# EAGLE schematic Sensor_POD (EAGLE 9.0.1)

## Sheet 1 of 8: Pre-amp (DONE)
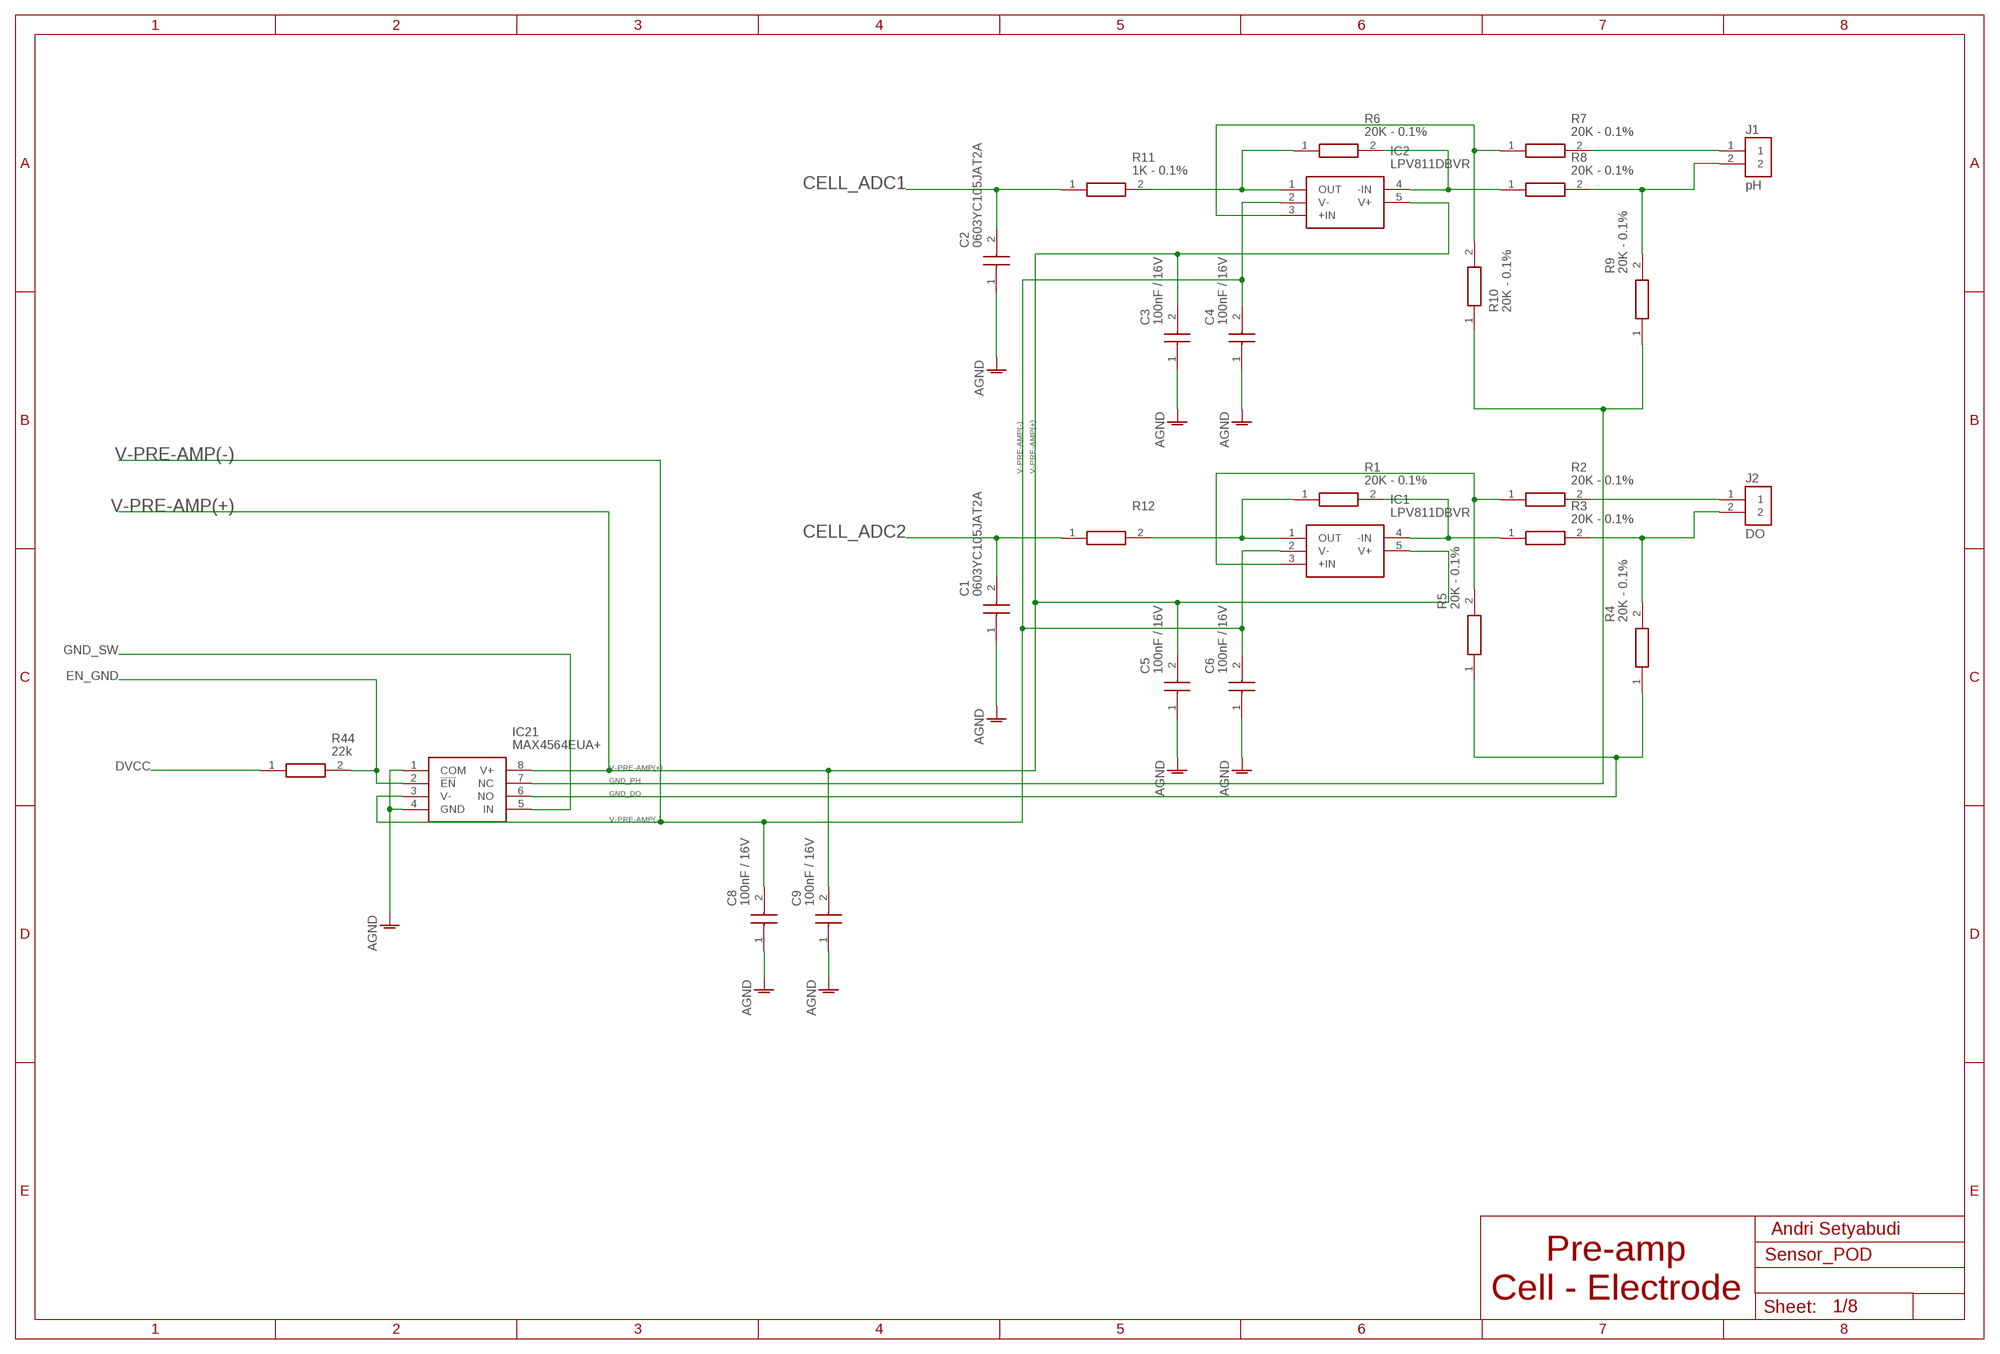
[diagram p0: schematic, sheet 1]

### Parts
C1  0603YC105JAT2A  [CAPC1608X90N]
C2  0603YC105JAT2A  [CAPC1608X90N]
C3  100nF / 16V  0603YC104JAT2A  [CAPC1608X90N]
C4  100nF / 16V  0603YC104JAT2A  [CAPC1608X90N]
C5  100nF / 16V  0603YC104JAT2A  [CAPC1608X90N]
C6  100nF / 16V  0603YC104JAT2A  [CAPC1608X90N]
C8  100nF / 16V  0603YC104JAT2A  [CAPC1608X90N]
C9  100nF / 16V  0603YC104JAT2A  [CAPC1608X90N]
IC1  LPV811DBVR  [SOT95P280X145-5N]
IC2  LPV811DBVR  [SOT95P280X145-5N]
IC21  MAX4564EUA+  [SOP65P490X110-8N]
J1  pH  B2B-PH-K-S(LF)(SN)  [JST_B2B-PH-K-S(LF)(SN)]
J2  DO  B2B-PH-K-S(LF)(SN)  [JST_B2B-PH-K-S(LF)(SN)]
R1  20K - 0.1%  ERA3AED203V  [RESC1608X55N@2]
R2  20K - 0.1%  ERA3AED203V  [RESC1608X55N@2]
R3  20K - 0.1%  ERA3AED203V  [RESC1608X55N@2]
R4  20K - 0.1%  ERA3AED203V  [RESC1608X55N@2]
R5  20K - 0.1%  ERA3AED203V  [RESC1608X55N@2]
R6  20K - 0.1%  ERA3AED203V  [RESC1608X55N@2]
R7  20K - 0.1%  ERA3AED203V  [RESC1608X55N@2]
R8  20K - 0.1%  ERA3AED203V  [RESC1608X55N@2]
R9  20K - 0.1%  ERA3AED203V  [RESC1608X55N@2]
R10  20K - 0.1%  ERA3AED203V  [RESC1608X55N@2]
R11  1K - 0.1%  RG1608P-102-B-T5  [RESC1608X50N]
R12  RG1608P-102-B-T5  [RESC1608X50N]
R44  22k  RT0603FRE0722KL  [RESC1608X55N]

### Nets
AGND: C1.1 C2.1 C3.1 C4.1 C5.1 C6.1 C8.1 C9.1 IC21.1(COM) IC21.4(GND) ; also sheet 2,4,5,6
CELL_ADC1: C2.2 R11.1 ; also sheet 6
CELL_ADC2: C1.2 R12.1 ; also sheet 6
DVCC: R44.1 ; also sheet 2,3,4,5,6,7
EN_GND: IC21.2(!EN) R44.2 ; also sheet 7
GND_DO: IC21.6(NO) R4.1 R5.1
GND_PH: IC21.7(NC) R9.1 R10.1
GND_SW: IC21.5(IN) ; also sheet 7
N$1: IC1.4(-IN) R1.2 R3.1
N$2: IC1.1(OUT) R1.1 R12.2
N$4: IC1.3(+IN) R2.1 R5.2
N$5: J2.2 R3.2 R4.2
N$6: J2.1 R2.2
N$10: IC2.4(-IN) R6.2 R8.1
N$11: IC2.1(OUT) R6.1 R11.2
N$12: IC2.3(+IN) R7.1 R10.2
N$13: J1.2 R8.2 R9.2
N$14: J1.1 R7.2
V-PRE-AMP(+): C3.2 C5.2 C9.2 IC1.5(V+) IC2.5(V+) IC21.8(V+) ; also sheet 3
V-PRE-AMP(-): C4.2 C6.2 C8.2 IC1.2(V-) IC2.2(V-) IC21.3(V-) ; also sheet 3

### Notes on the sheet
- Andri Setyabudi
- Pre-amp
  Cell - Electrode

## Sheet 2 of 8: Power Supply
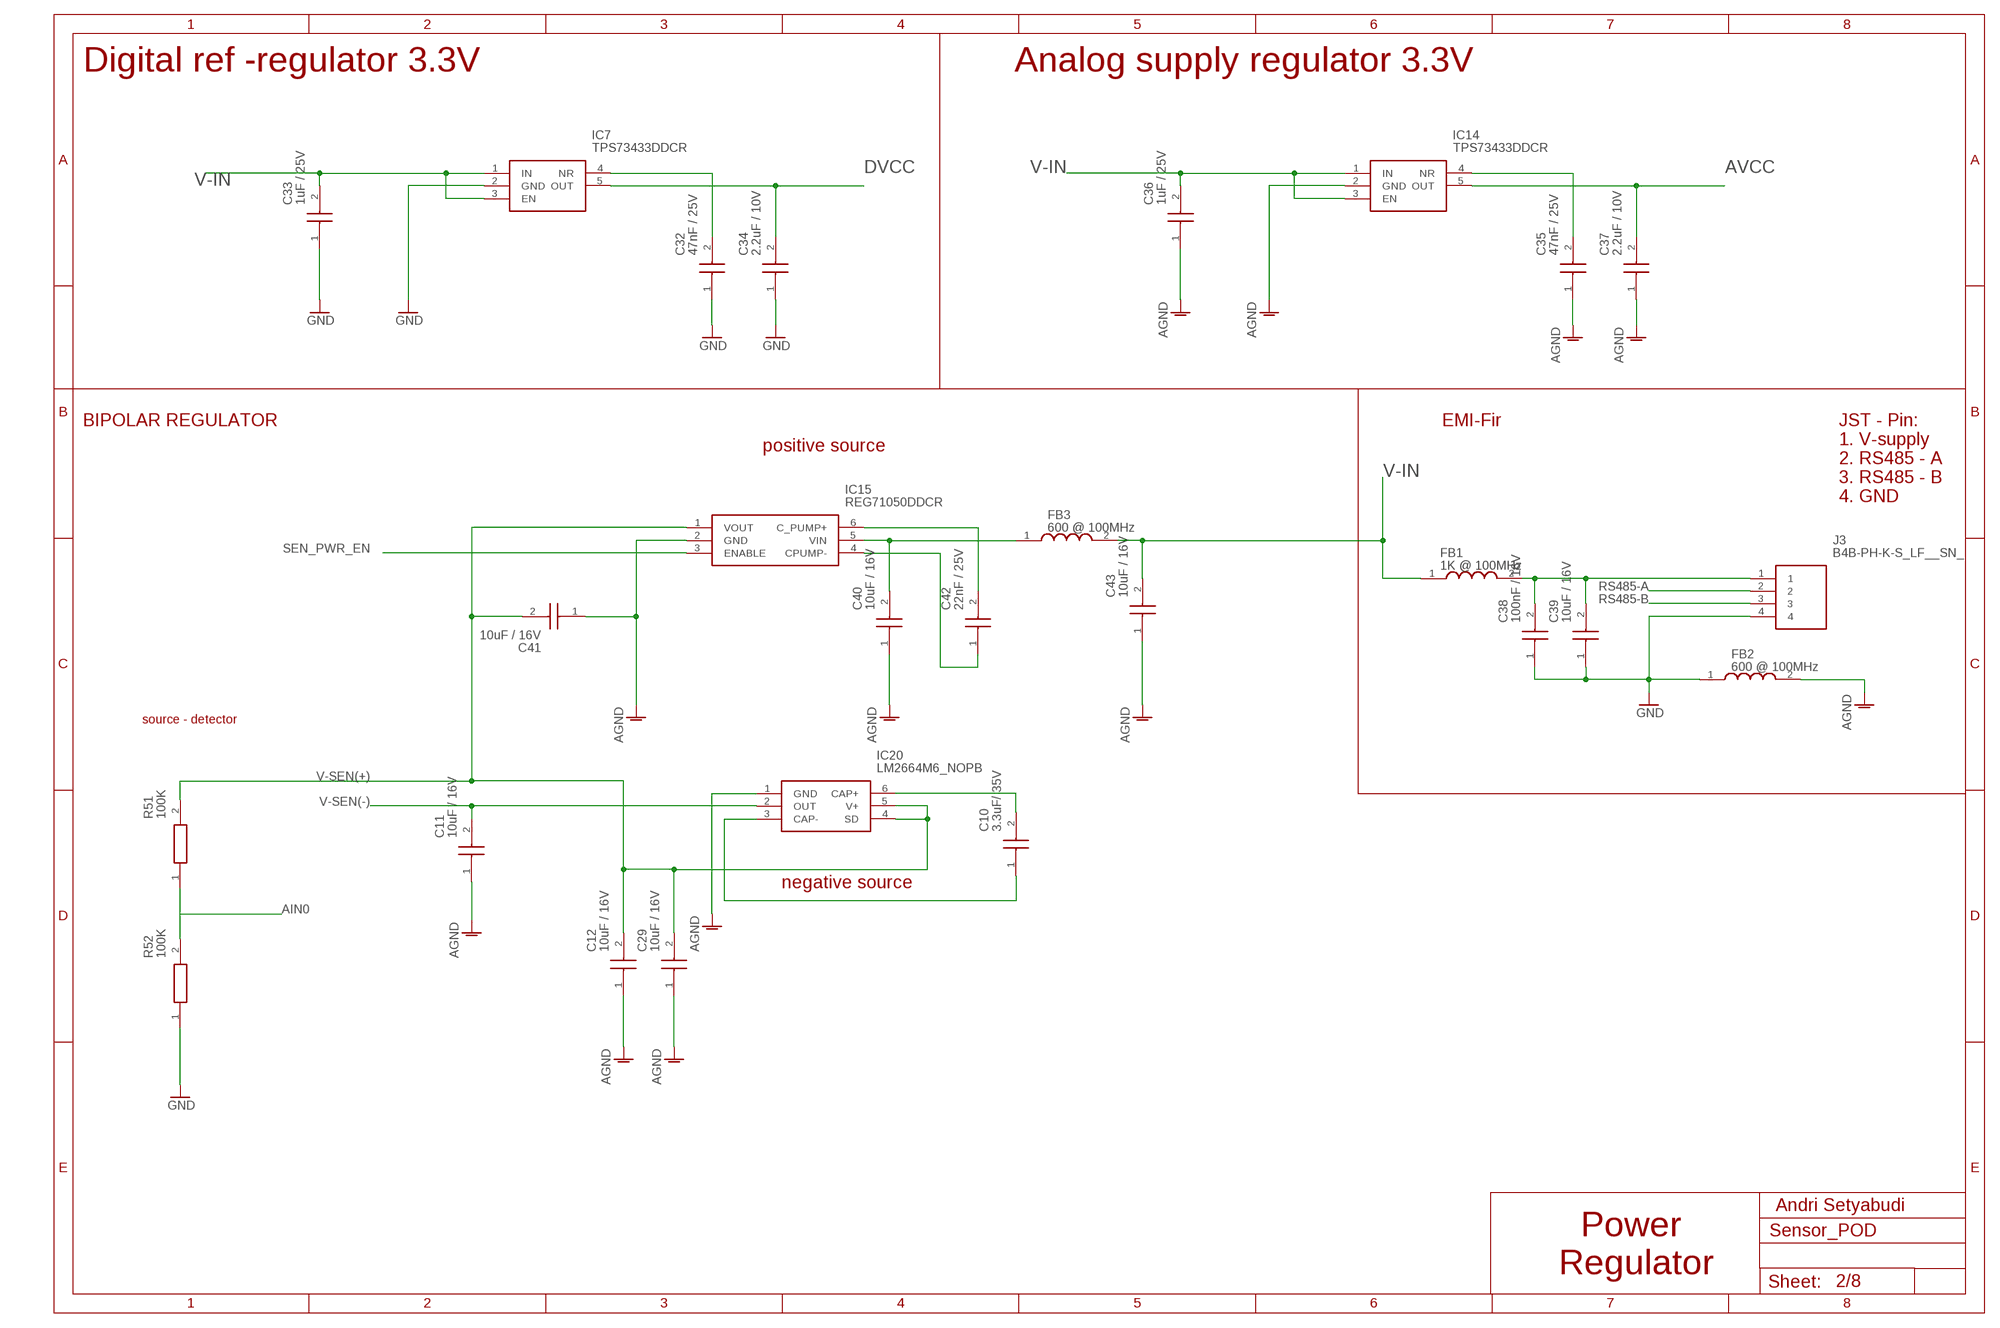
[diagram p1: schematic, sheet 2]

### Parts
C10  3.3uF/ 35V  0603YC105JAT2A  [CAPC1608X90N]
C11  10uF / 16V  EMK107BBJ106MA-T  [CAPC1608X100N]
C12  10uF / 16V  EMK107BBJ106MA-T  [CAPC1608X100N]
C29  10uF / 16V  EMK107BBJ106MA-T  [CAPC1608X100N]
C32  47nF / 25V  06033C473KAT2A  [CAPC1608X90N@1]
C33  1uF / 25V  TMK107B7105KA-T  [CAPC1608X90N@1]
C34  2.2uF / 10V  CL10B225KP8NFNC  [CAPC1608X90N@1]
C35  47nF / 25V  06033C473KAT2A  [CAPC1608X90N@1]
C36  1uF / 25V  TMK107B7105KA-T  [CAPC1608X90N@1]
C37  2.2uF / 10V  CL10B225KP8NFNC  [CAPC1608X90N@1]
C38  100nF / 16V  EMK107BJ104KAHT  [CAPC1608X90N@1]
C39  10uF / 16V  EMK107BBJ106MA-T  [CAPC1608X100N]
C40  10uF / 16V  EMK107BBJ106MA-T  [CAPC1608X100N]
C41  10uF / 16V  EMK107BBJ106MA-T  [CAPC1608X100N]
C42  22nF / 25V  CGA3E2X5R1E224K080AA  [CAPC1608X90N@1]
C43  10uF / 16V  EMK107BBJ106MA-T  [CAPC1608X100N]
FB1  1K @ 100MHz  BLM18KG102SH1D  [BLM18KG102SH1J]
FB2  600 @ 100MHz  MPZ1608S601ATA00  [BEADC1608X75N]
FB3  600 @ 100MHz  MPZ1608S601ATA00  [BEADC1608X75N]
IC7  TPS73433DDCR  [SOT95P280X110-5N]
IC14  TPS73433DDCR  [SOT95P280X110-5N]
IC15  REG71050DDCR  [SOT95P280X110-6N]
IC20  LM2664M6_NOPB  [SOT95P280X145-6N]
J3  B4B-PH-K-S_LF__SN_  [SHDR4W50P0X200_1X4_990X450X600]
R51  100K  RT0603DRE07100KL  [RESC1608X55N@1]
R52  100K  RT0603DRE07100KL  [RESC1608X55N@1]

### Nets
AGND: C11.1 C12.1 C29.1 C35.1 C36.1 C37.1 C40.1 C41.1 C43.1 FB2.2 IC14.2(GND) IC15.2(GND) IC20.1(GND) ; also sheet 1,4,5,6
AIN0: R51.1 R52.2 ; also sheet 7
AVCC: C37.2 IC14.5(OUT) ; also sheet 5,6
DVCC: C34.2 IC7.5(OUT) ; also sheet 1,3,4,5,6,7
GND: C32.1 C33.1 C34.1 C38.1 C39.1 FB2.1 IC7.2(GND) J3.4 R52.1 ; also sheet 3,5,6,7
N$7: C42.2 IC15.6(C_PUMP+)
N$8: C10.2 IC20.6(CAP+)
N$9: C42.1 IC15.4(CPUMP-)
N$15: C10.1 IC20.3(CAP-)
N$25: C32.2 IC7.4(NR)
N$26: C40.2 FB3.1 IC15.5(VIN)
N$27: C35.2 IC14.4(NR)
N$29: C38.2 C39.2 FB1.2 J3.1
RS485-A: J3.2 ; also sheet 7
RS485-B: J3.3 ; also sheet 7
SEN_PWR_EN: IC15.3(ENABLE) ; also sheet 7
V-IN: C33.2 C36.2 C43.2 FB1.1 FB3.2 IC7.1(IN) IC7.3(EN) IC14.1(IN) IC14.3(EN) ; also sheet 7
V-SEN(+): C12.2 C29.2 C41.2 IC15.1(VOUT) IC20.4(SD) IC20.5(V+) R51.2 ; also sheet 3,6
V-SEN(-): C11.2 IC20.2(OUT) ; also sheet 3,6

### Notes on the sheet
- Digital ref -regulator 3.3V | Analog supply regulator 3.3V
- BIPOLAR REGULATOR | EMI-Fir
- positive source
- JST - Pin:
  1. V-supply
  2. RS485 - A
  3. RS485 - B
  4. GND
- source - detector
- negative source
- Andri Setyabudi
- Power 
  Regulator

## Sheet 3 of 8: Analog Switch on/off (DONE)
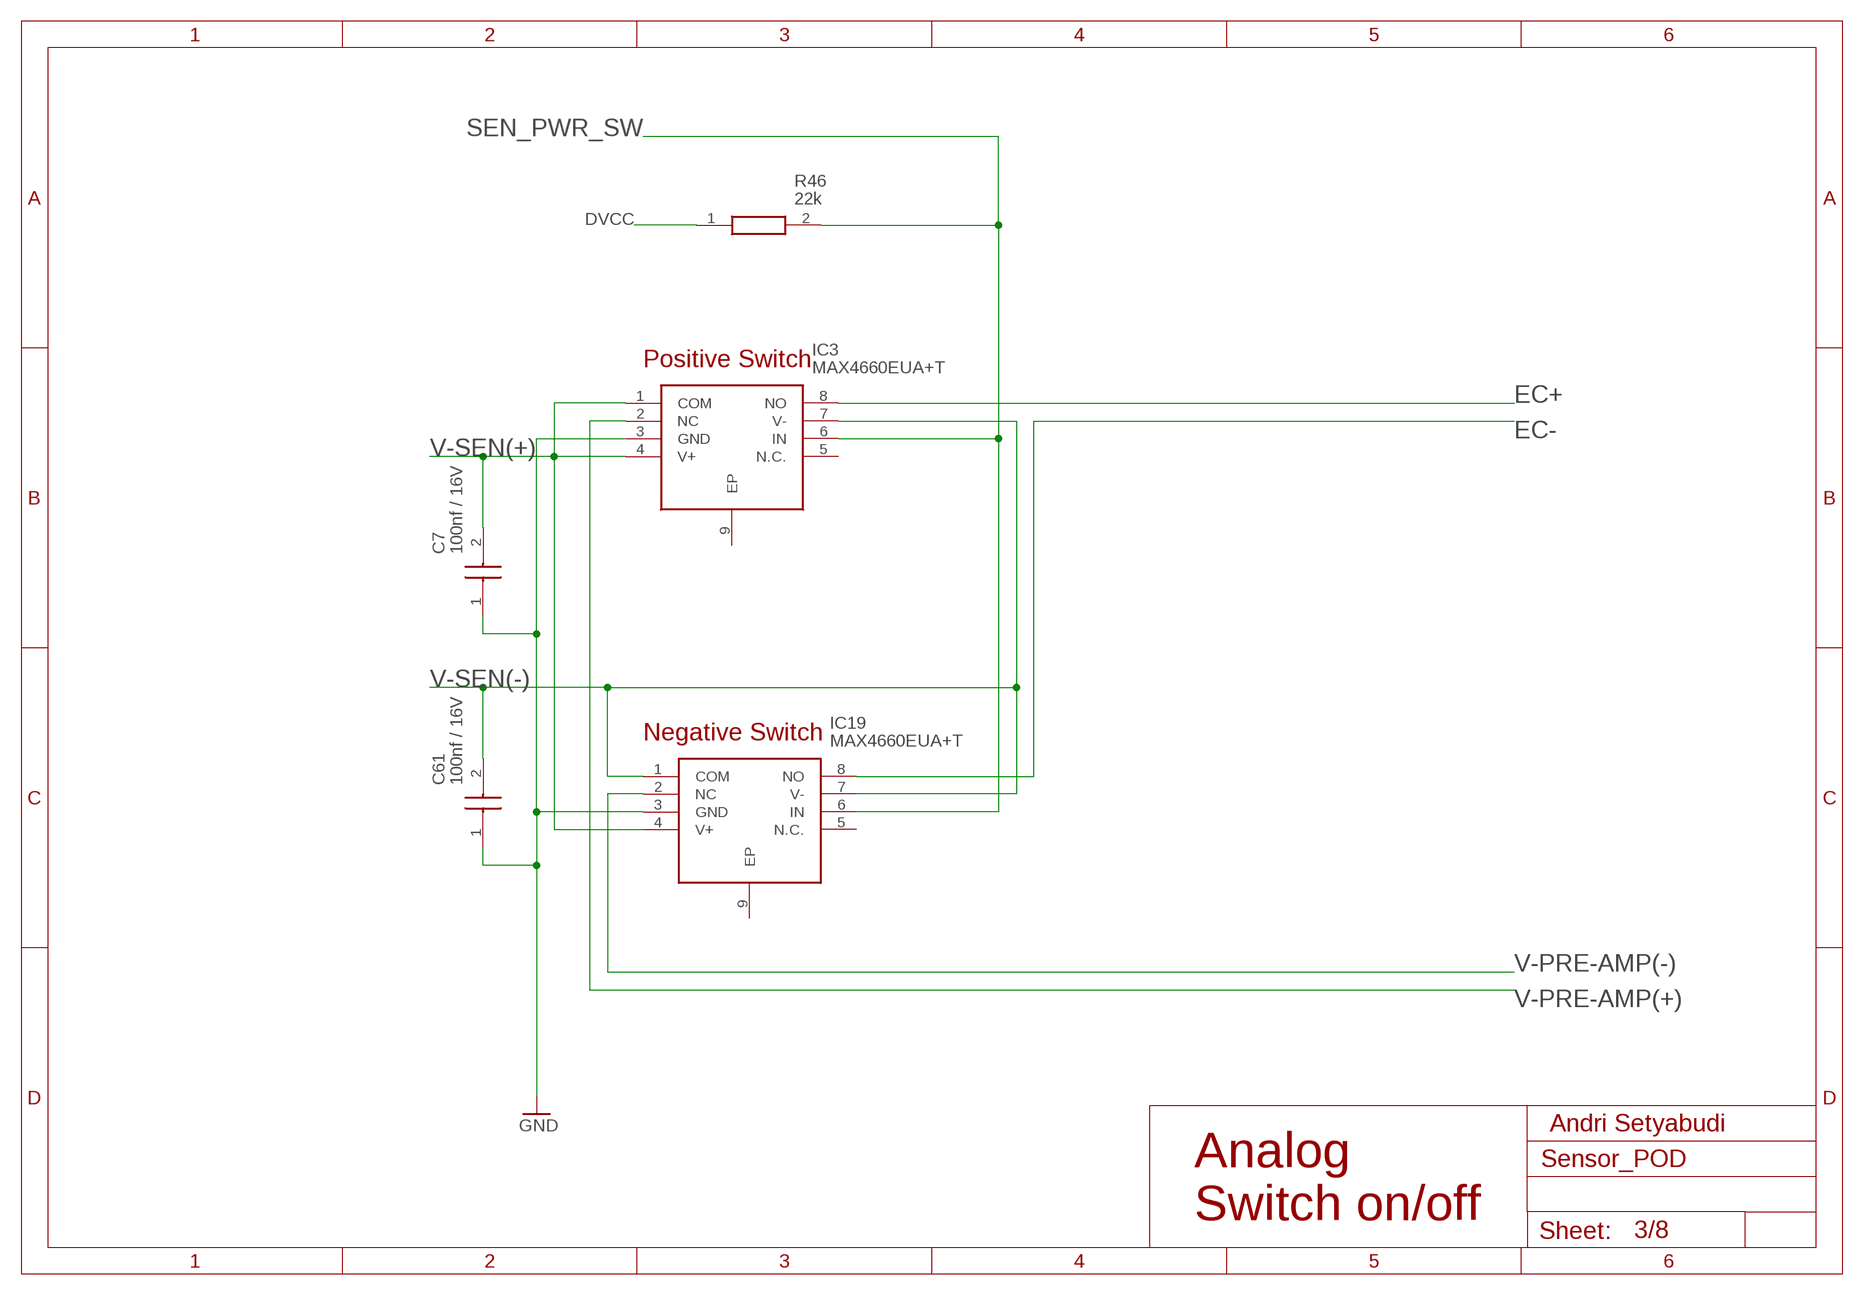
[diagram p2: schematic, sheet 3]

### Parts
C7  100nf / 16V  0603YC104JAT2A  [CAPC1608X90N]
C61  100nf / 16V  0603YC104JAT2A  [CAPC1608X90N]
IC3  MAX4660EUA+T  [SOP65P490X110-9N]
IC19  MAX4660EUA+T  [SOP65P490X110-9N]
R46  22k  RT0603FRE0722KL  [RESC1608X55N]

### Nets
DVCC: R46.1 ; also sheet 1,2,4,5,6,7
EC+: IC3.8(NO) ; also sheet 4
EC-: IC19.8(NO) ; also sheet 4
GND: C7.1 C61.1 IC3.3(GND) IC19.3(GND) ; also sheet 2,5,6,7
SEN_PWR_SW: IC3.6(IN) IC19.6(IN) R46.2
V-PRE-AMP(+): IC3.2(NC) ; also sheet 1
V-PRE-AMP(-): IC19.2(NC) ; also sheet 1
V-SEN(+): C7.2 IC3.1(COM) IC3.4(V+) IC19.4(V+) ; also sheet 2,6
V-SEN(-): C61.2 IC3.7(V-) IC19.1(COM) IC19.7(V-) ; also sheet 2,6
Unconnected: IC3.5(N.C.) IC3.9(EP) IC19.5(N.C.) IC19.9(EP)

### Notes on the sheet
- Positive Switch
- Negative Switch
- Andri Setyabudi
- Analog
  Switch on/off

## Sheet 4 of 8: Conductivity Driver (DONE)
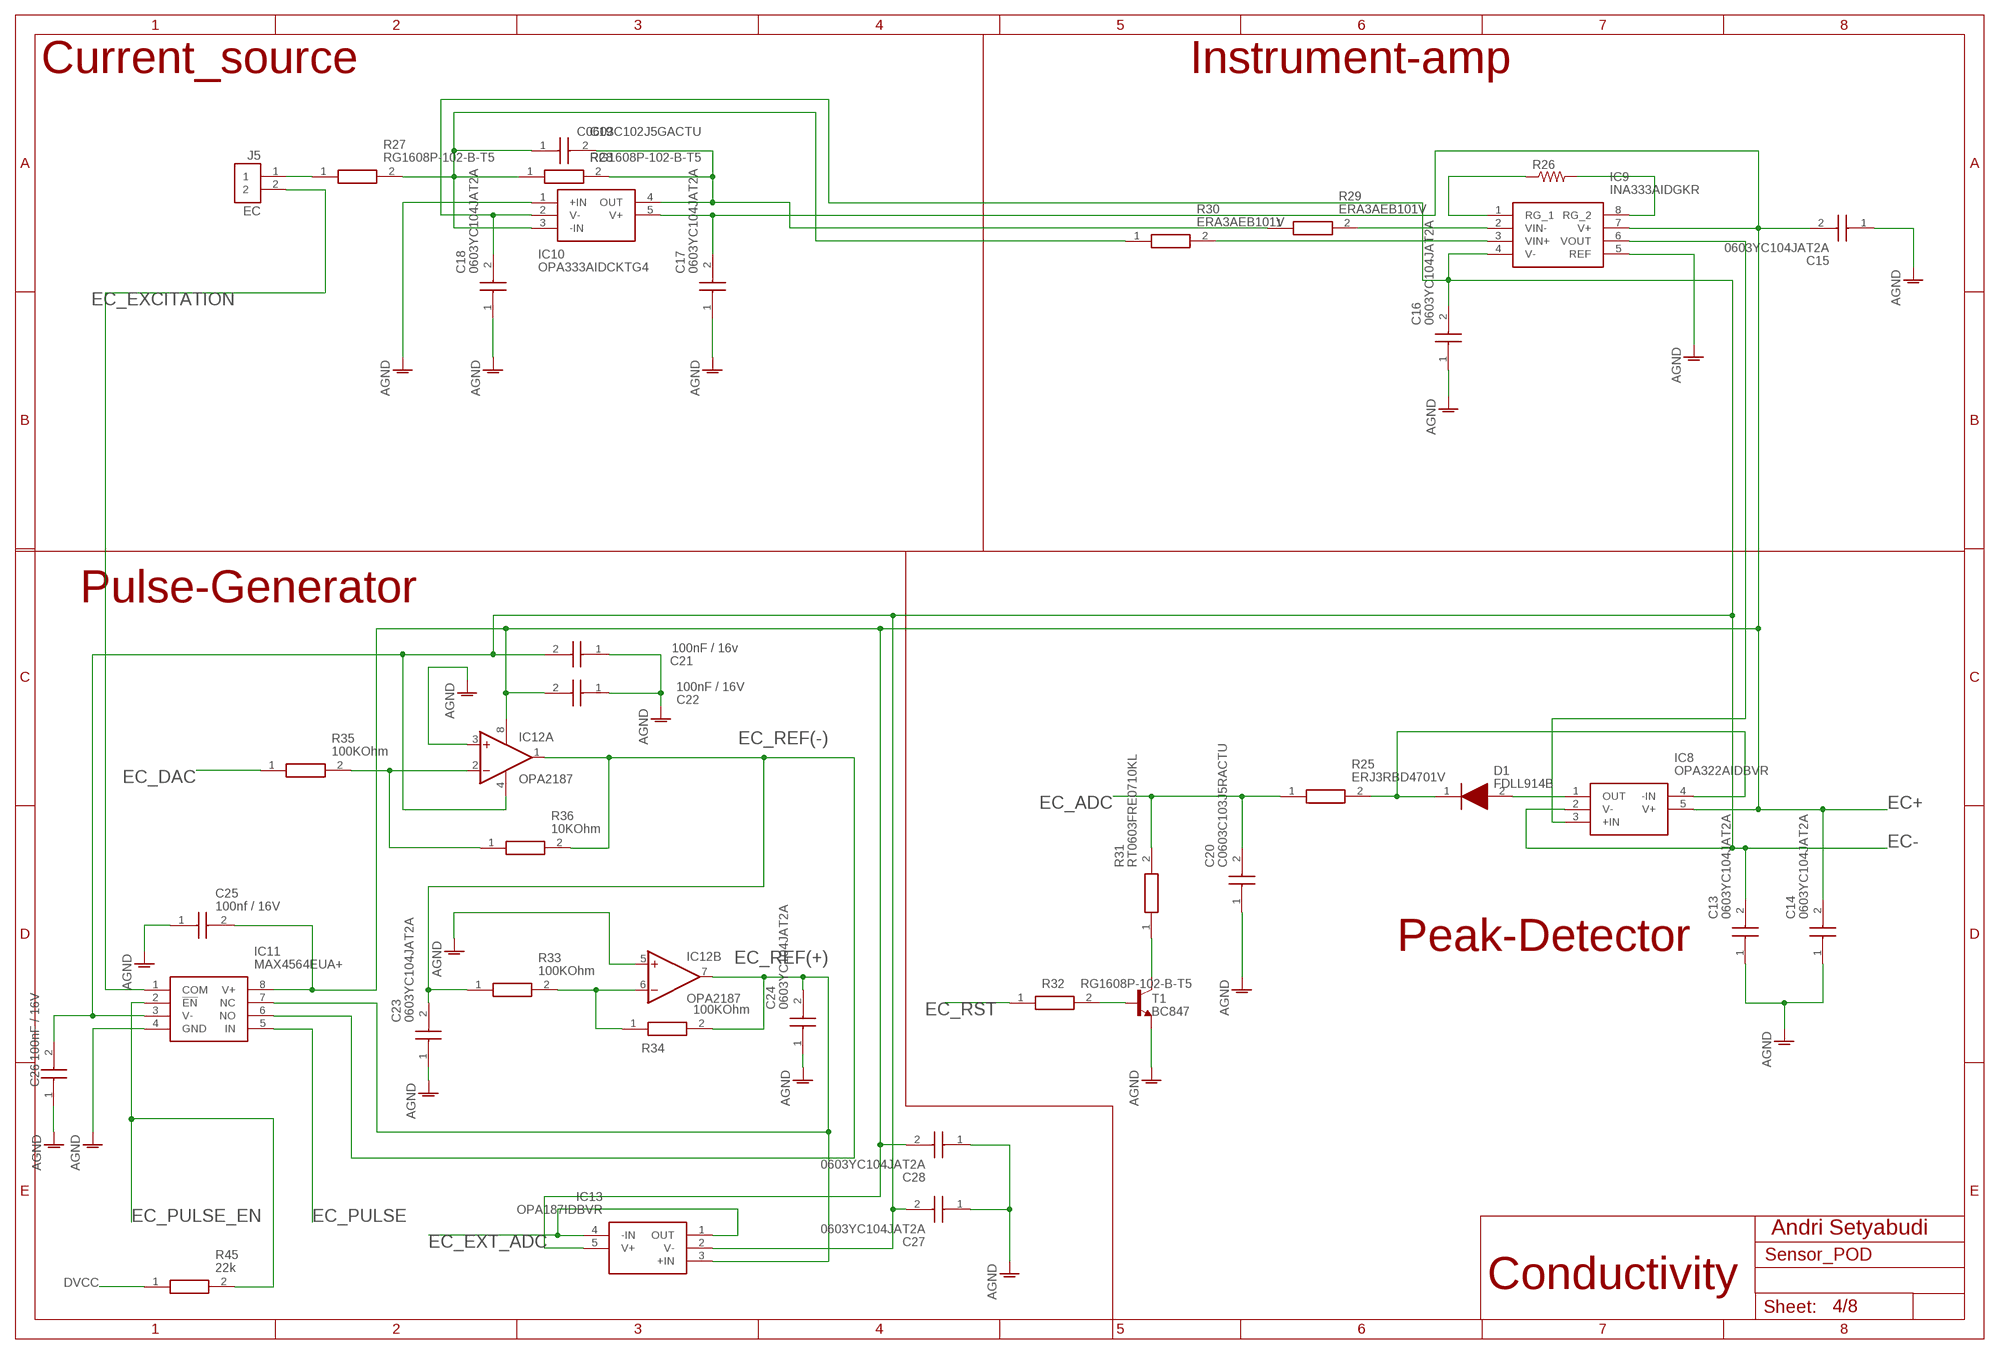
[diagram p3: schematic, sheet 4]

### Parts
C13  0603YC104JAT2A  [CAPC1608X90N]
C14  0603YC104JAT2A  [CAPC1608X90N]
C15  0603YC104JAT2A  [CAPC1608X90N]
C16  0603YC104JAT2A  [CAPC1608X90N]
C17  0603YC104JAT2A  [CAPC1608X90N]
C18  0603YC104JAT2A  [CAPC1608X90N]
C19  C0603C102J5GACTU  [CAPC1608X85N]
C20  C0603C103J5RACTU  [CAPC1608X87N]
C21  100nF / 16v  0603YC104JAT2A  [CAPC1608X90N]
C22  100nF / 16V  0603YC104JAT2A  [CAPC1608X90N]
C23  0603YC104JAT2A  [CAPC1608X90N]
C24  0603YC104JAT2A  [CAPC1608X90N]
C25  100nf / 16V  0603YC104JAT2A  [CAPC1608X90N]
C26  100nF / 16V  0603YC104JAT2A  [CAPC1608X90N]
C27  0603YC104JAT2A  [CAPC1608X90N]
C28  0603YC104JAT2A  [CAPC1608X90N]
D1  FDLL914B  [FDLL914B]
IC8  OPA322AIDBVR  [SOT95P280X145-5N]
IC9  INA333AIDGKR  [SOP65P490X110-8N]
IC10  OPA333AIDCKTG4  [SOT65P210X110-5N]
IC11  MAX4564EUA+  [SOP65P490X110-8N]
IC12  OPA2187  OPA2107D  [SO08]
IC13  OPA187IDBVR  [SOT95P280X145-5N]
J5  EC  B2B-PH-K-S(LF)(SN)  [JST_B2B-PH-K-S(LF)(SN)]
R25  ERJ3RBD4701V  [RESC1608X55N]
R26  R-US_R0603  [R0603]
R27  RG1608P-102-B-T5  [RESC1608X50N]
R28  RG1608P-102-B-T5  [RESC1608X50N]
R29  ERA3AEB101V  [RESC1608X55N@2]
R30  ERA3AEB101V  [RESC1608X55N@2]
R31  RT0603FRE0710KL  [RESC1608X55N@2]
R32  RG1608P-102-B-T5  [RESC1608X50N]
R33  100KOhm  RT0603DRE07100KL  [RESC1608X55N@1]
R34  100KOhm  RT0603DRE07100KL  [RESC1608X55N@1]
R35  100KOhm  RT0603DRE07100KL  [RESC1608X55N@1]
R36  10KOhm  RT0603FRE0710KL  [RESC1608X55N@2]
R45  22k  RT0603FRE0722KL  [RESC1608X55N]
T1  BC847  [SOT23]

### Nets
AGND: C13.1 C14.1 C15.1 C16.1 C17.1 C18.1 C20.1 C21.1 C22.1 C23.1 C24.1 C25.1 C26.1 C27.1 C28.1 IC9.5(REF) IC10.1(+IN) IC11.4(GND) IC12.3(A:+IN) IC12.5(B:+IN) T1.2(E) ; also sheet 1,2,5,6
DVCC: R45.1 ; also sheet 1,2,3,5,6,7
EC+: C14.2 C15.2 C17.2 C22.2 C25.2 C28.2 IC8.5(V+) IC9.7(V+) IC10.5(V+) IC11.8(V+) IC12.8(P:V+) IC13.5(V+) ; also sheet 3
EC-: C13.2 C16.2 C18.2 C21.2 C26.2 C27.2 IC8.2(V-) IC9.4(V-) IC10.2(V-) IC11.3(V-) IC12.4(P:V-) IC13.2(V-) ; also sheet 3
EC_ADC: C20.2 R25.1 R31.2 ; also sheet 6
EC_DAC: R35.1 ; also sheet 7
EC_EXCITATION: IC11.1(COM) J5.2
EC_EXT_ADC: IC13.1(OUT) IC13.4(-IN) ; also sheet 6
EC_PULSE: IC11.5(IN) ; also sheet 7
EC_PULSE_EN: IC11.2(!EN) R45.2 ; also sheet 7
EC_REF(+): C24.2 IC11.7(NC) IC12.7(B:OUT) IC13.3(+IN) R34.2
EC_REF(-): C23.2 IC11.6(NO) IC12.1(A:OUT) R33.1 R36.2
EC_RST: R32.1 ; also sheet 7
N$3: D1.2(A) IC8.1(OUT)
N$34: D1.1(K) IC8.4(-IN) R25.2
N$35: R31.1 T1.3(C)
N$36: R32.2 T1.1(B)
N$37: IC9.8(RG_2) R26.2
N$38: IC9.1(RG_1) R26.1
N$39: J5.1 R27.1
N$40: IC12.6(B:-IN) R33.2 R34.1
N$44: C19.1(C1) IC10.3(-IN) R27.2 R28.1 R30.1
N$45: C19.2(C2) IC10.4(OUT) R28.2 R29.1
N$46: IC9.2(VIN-) R29.2
N$47: IC9.3(VIN+) R30.2
N$48: IC12.2(A:-IN) R35.2 R36.1
N$50: IC8.3(+IN) IC9.6(VOUT)

### Notes on the sheet
- Current_source | Instrument-amp
- Pulse-Generator
- Peak-Detector
- Andri Setyabudi
- Conductivity

## Sheet 5 of 8: Temperature ( NTC ) Driver (DONE)
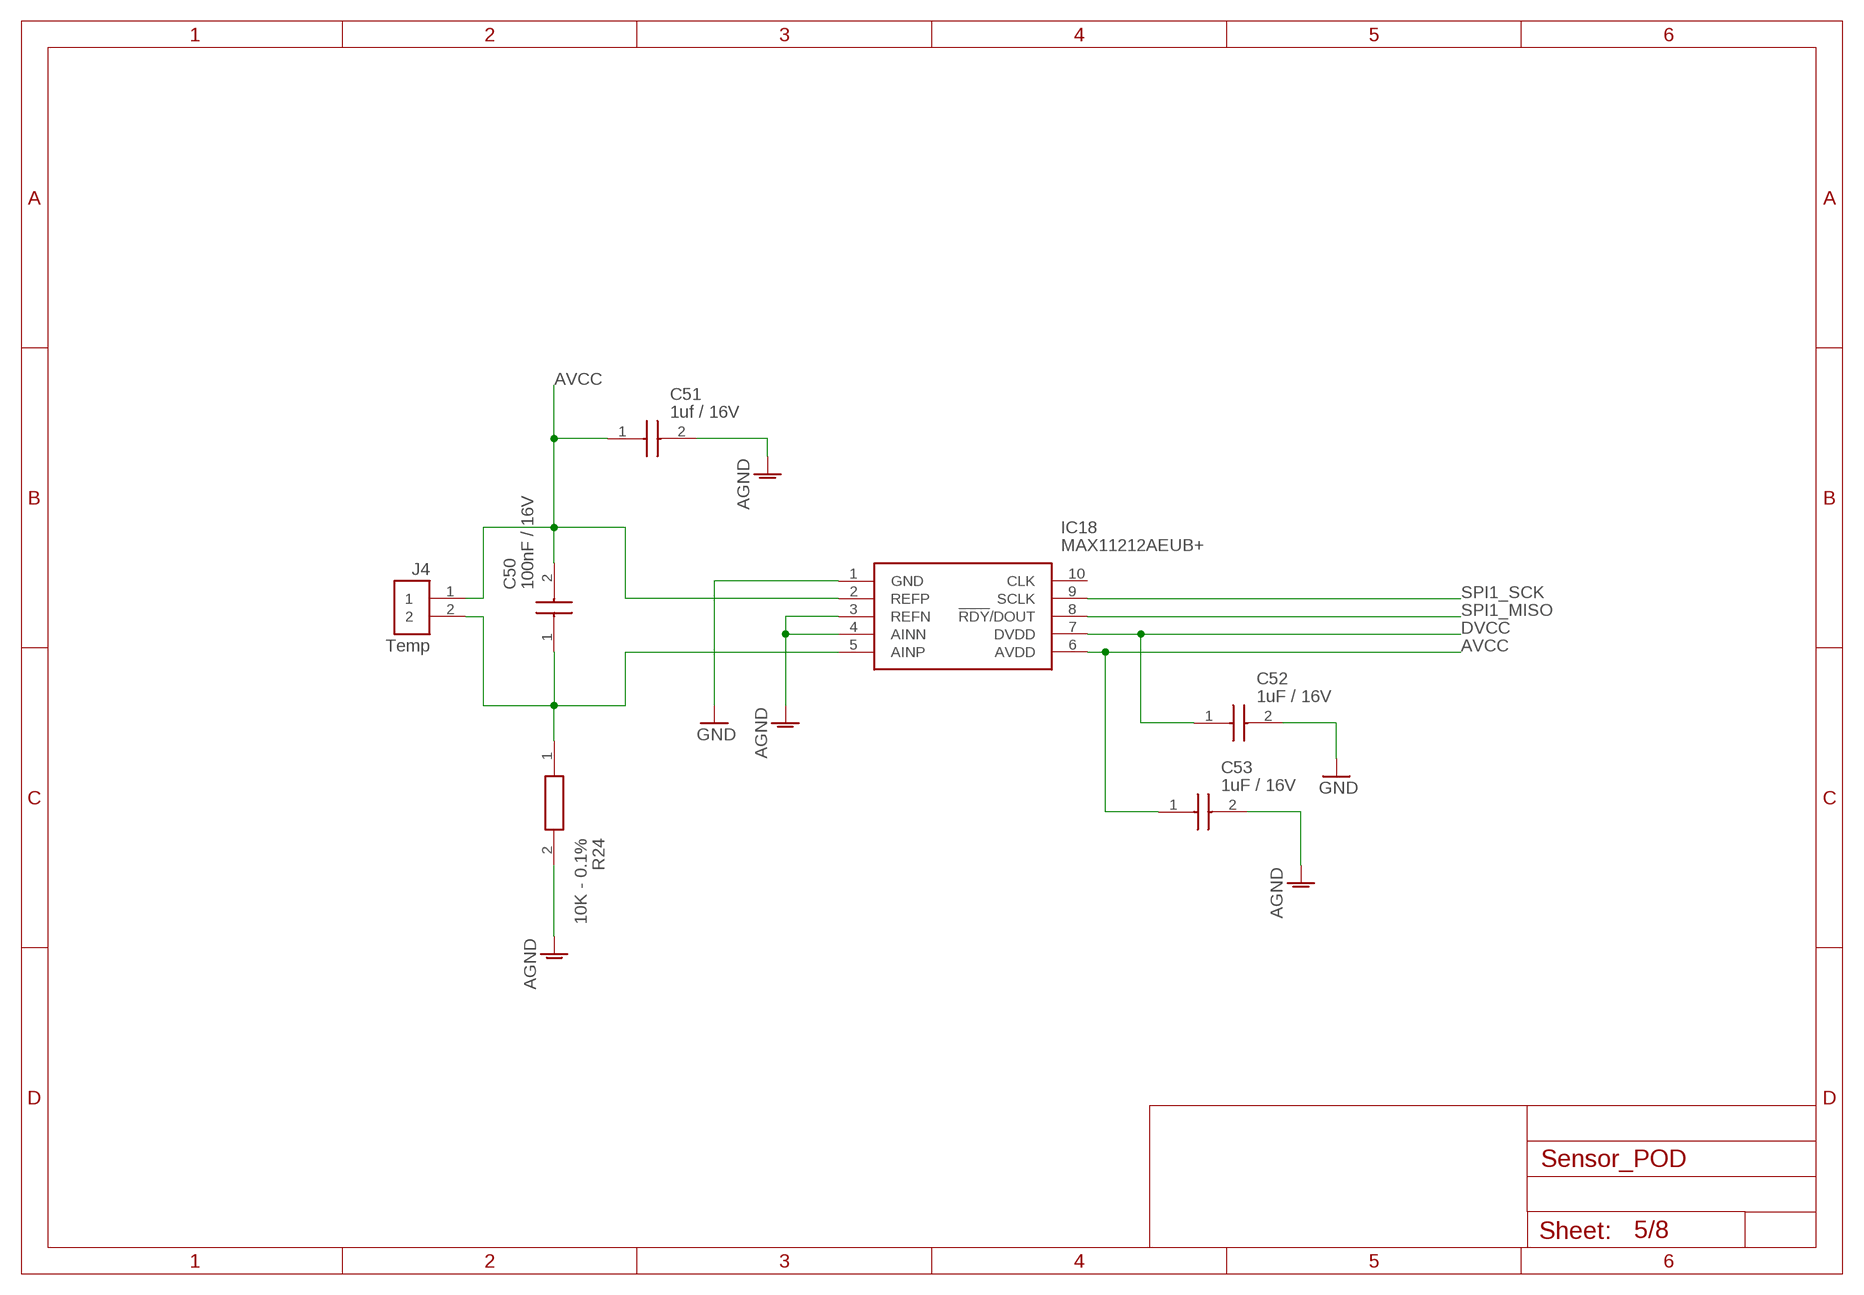
[diagram p4: schematic, sheet 5]

### Parts
C50  100nF / 16V  0603YC104JAT2A  [CAPC1608X90N]
C51  1uf / 16V  0603YC105JAT2A  [CAPC1608X90N]
C52  1uF / 16V  0603YC105JAT2A  [CAPC1608X90N]
C53  1uF / 16V  0603YC105JAT2A  [CAPC1608X90N]
IC18  MAX11212AEUB+  [SOP50P490X110-10N]
J4  Temp  B2B-PH-K-S(LF)(SN)  [JST_B2B-PH-K-S(LF)(SN)]
R24  10K - 0.1%  ERA-3AEB103V  [RESC1608X55N@2]

### Nets
AGND: C51.2 C53.2 IC18.3(REFN) IC18.4(AINN) R24.2 ; also sheet 1,2,4,6
AVCC: C50.2 C51.1 C53.1 IC18.2(REFP) IC18.6(AVDD) J4.1 ; also sheet 2,6
DVCC: C52.1 IC18.7(DVDD) ; also sheet 1,2,3,4,6,7
GND: C52.2 IC18.1(GND) ; also sheet 2,3,6,7
N$28: C50.1 IC18.5(AINP) J4.2 R24.1
SPI1_MISO: IC18.8(!RDY!/DOUT) ; also sheet 7
SPI1_SCK: IC18.9(SCLK) ; also sheet 7
Unconnected: IC18.10(CLK)

## Sheet 6 of 8: A/D Converter (DONE)
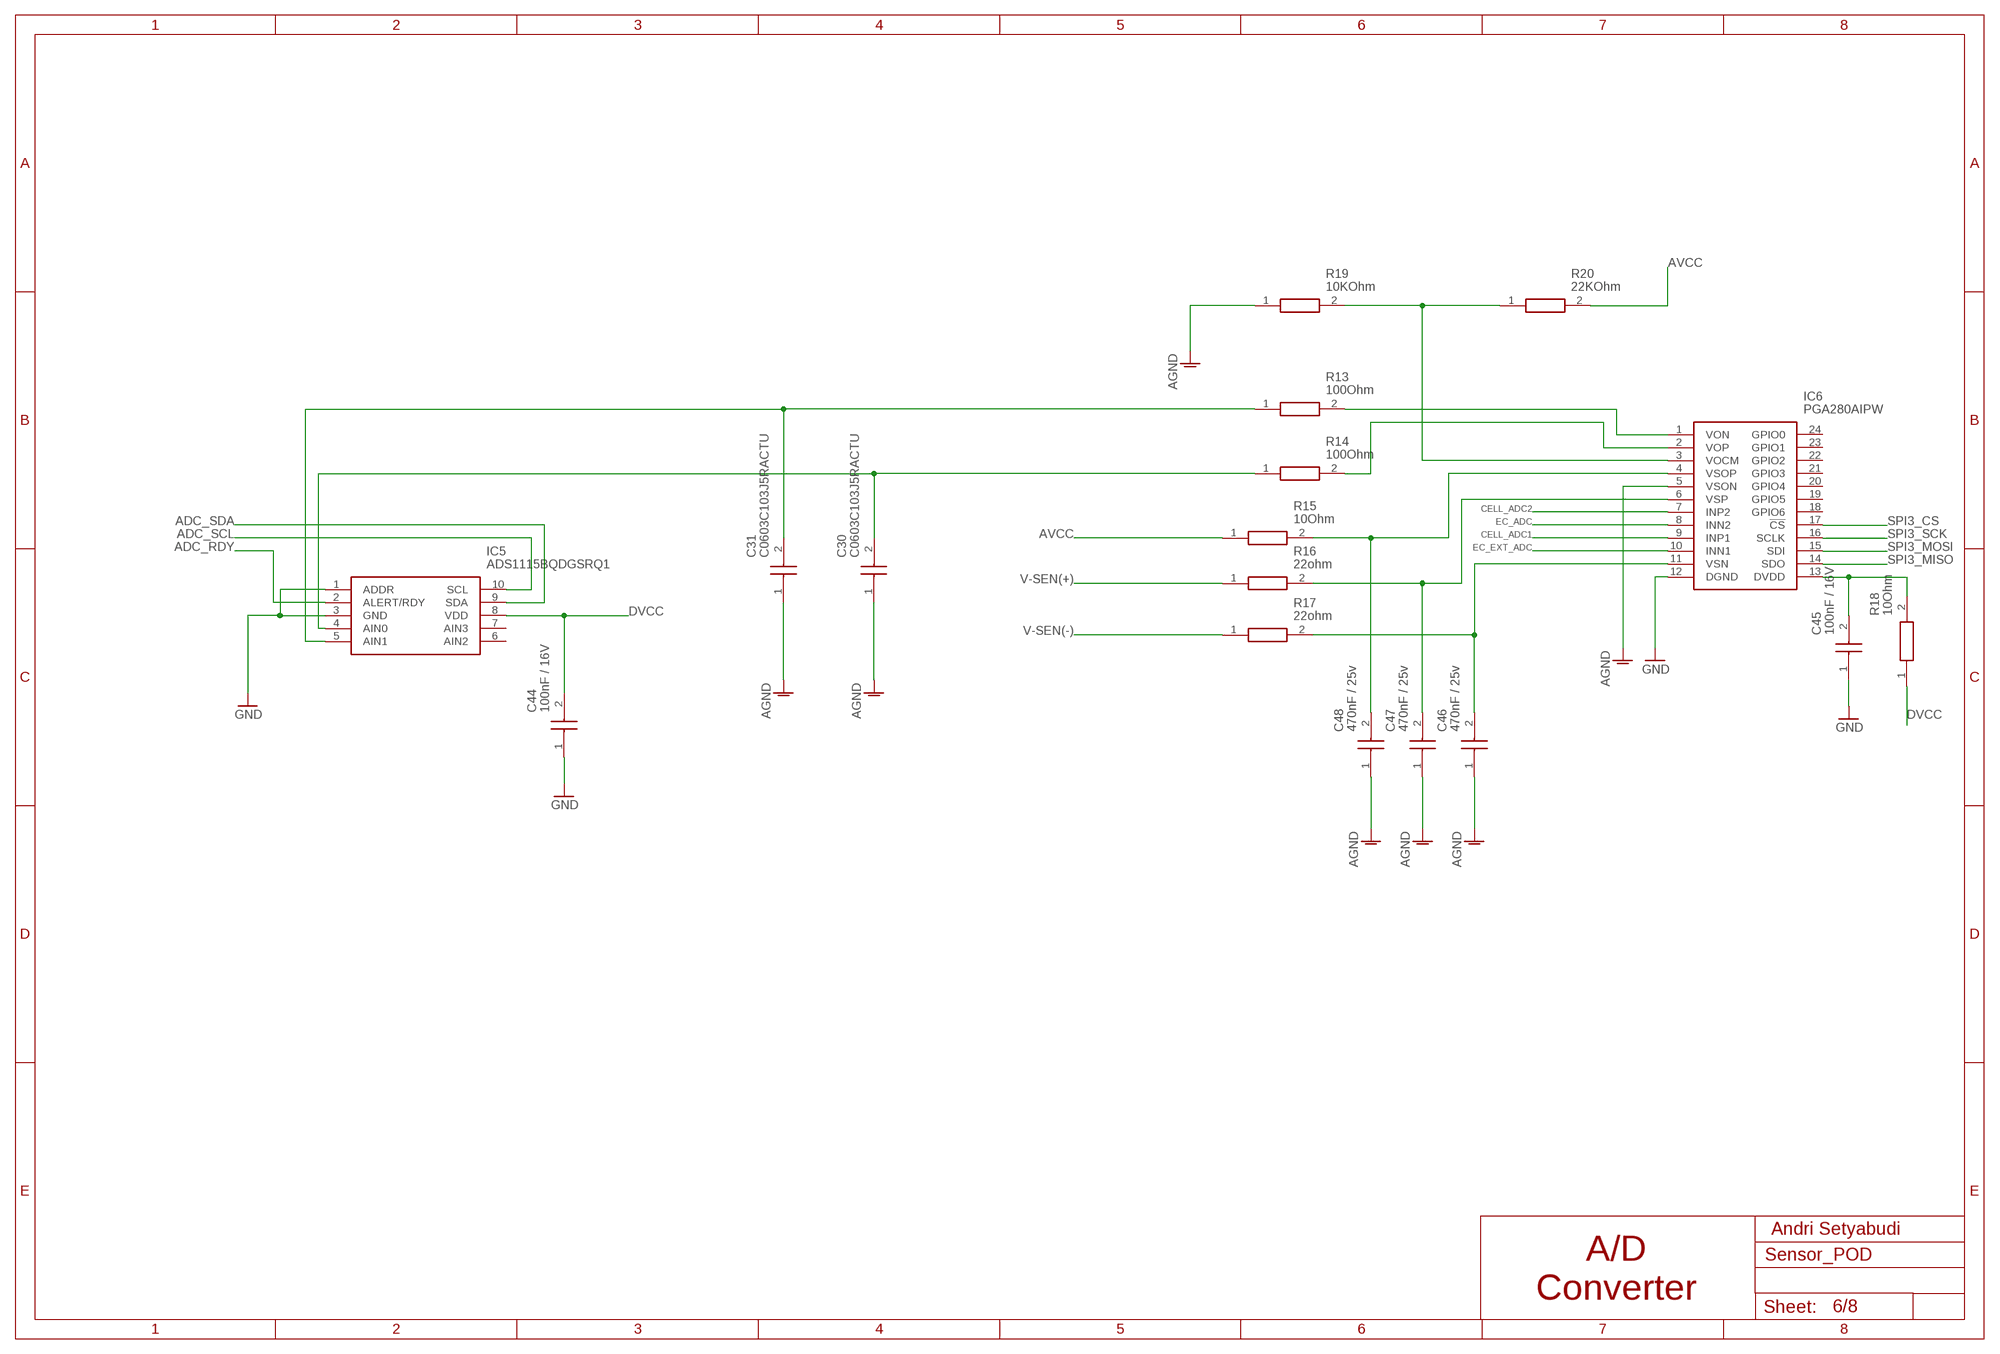
[diagram p5: schematic, sheet 6]

### Parts
C30  C0603C103J5RACTU  [CAPC1608X87N]
C31  C0603C103J5RACTU  [CAPC1608X87N]
C44  100nF / 16V  0603YC104JAT2A  [CAPC1608X90N]
C45  100nF / 16V  0603YC104JAT2A  [CAPC1608X90N]
C46  470nF / 25v  GRM188R61E474KA12D  [CAPC1608X90N@1]
C47  470nF / 25v  GRM188R61E474KA12D  [CAPC1608X90N@1]
C48  470nF / 25v  GRM188R61E474KA12D  [CAPC1608X90N@1]
IC5  ADS1115BQDGSRQ1  [SOP50P490X110-10N]
IC6  PGA280AIPW  [SOP65P640X120-24N]
R13  100Ohm  ERA3AEB101V  [RESC1608X55N@2]
R14  100Ohm  ERA3AEB101V  [RESC1608X55N@2]
R15  10Ohm  RT0603FRD0710RL  [RESC1608X55N@2]
R16  22ohm  ERJ-PA3J220V  [RESC1608X55N@2]
R17  22ohm  ERJ-PA3J220V  [RESC1608X55N@2]
R18  10Ohm  RT0603FRD0710RL  [RESC1608X55N@2]
R19  10KOhm  RT0603FRE0710KL  [RESC1608X55N@2]
R20  22KOhm  RT0603FRE0722KL  [RESC1608X55N]

### Nets
ADC_RDY: IC5.2(ALERT/RDY) ; also sheet 7
ADC_SCL: IC5.10(SCL) ; also sheet 7
ADC_SDA: IC5.9(SDA) ; also sheet 7
AGND: C30.1 C31.1 C46.1 C47.1 C48.1 IC6.5(VSON) R19.1 ; also sheet 1,2,4,5
AVCC: R15.1 R20.2 ; also sheet 2,5
CELL_ADC1: IC6.9(INP1) ; also sheet 1
CELL_ADC2: IC6.7(INP2) ; also sheet 1
DVCC: C44.2 IC5.8(VDD) R18.1 ; also sheet 1,2,3,4,5,7
EC_ADC: IC6.8(INN2) ; also sheet 4
EC_EXT_ADC: IC6.10(INN1) ; also sheet 4
GND: C44.1 C45.1 IC5.1(ADDR) IC5.3(GND) IC6.12(DGND) ; also sheet 2,3,5,7
N$18: C30.2 IC5.4(AIN0) R14.1
N$19: C31.2 IC5.5(AIN1) R13.1
N$20: IC6.1(VON) R13.2
N$21: IC6.3(VOCM) R19.2 R20.1
N$22: IC6.2(VOP) R14.2
N$30: C48.2 IC6.4(VSOP) R15.2
N$31: C47.2 IC6.6(VSP) R16.2
N$32: C46.2 IC6.11(VSN) R17.2
N$33: C45.2 IC6.13(DVDD) R18.2
SPI3_CS: IC6.17(!CS) ; also sheet 7
SPI3_MISO: IC6.14(SDO) ; also sheet 7
SPI3_MOSI: IC6.15(SDI) ; also sheet 7
SPI3_SCK: IC6.16(SCLK) ; also sheet 7
V-SEN(+): R16.1 ; also sheet 2,3
V-SEN(-): R17.1 ; also sheet 2,3
Unconnected: IC5.6(AIN2) IC5.7(AIN3) IC6.18(GPIO6) IC6.19(GPIO5) IC6.20(GPIO4) IC6.21(GPIO3) IC6.22(GPIO2) IC6.23(GPIO1) IC6.24(GPIO0)

### Notes on the sheet
- Andri Setyabudi
- A/D
  Converter

## Sheet 7 of 8: data & controller
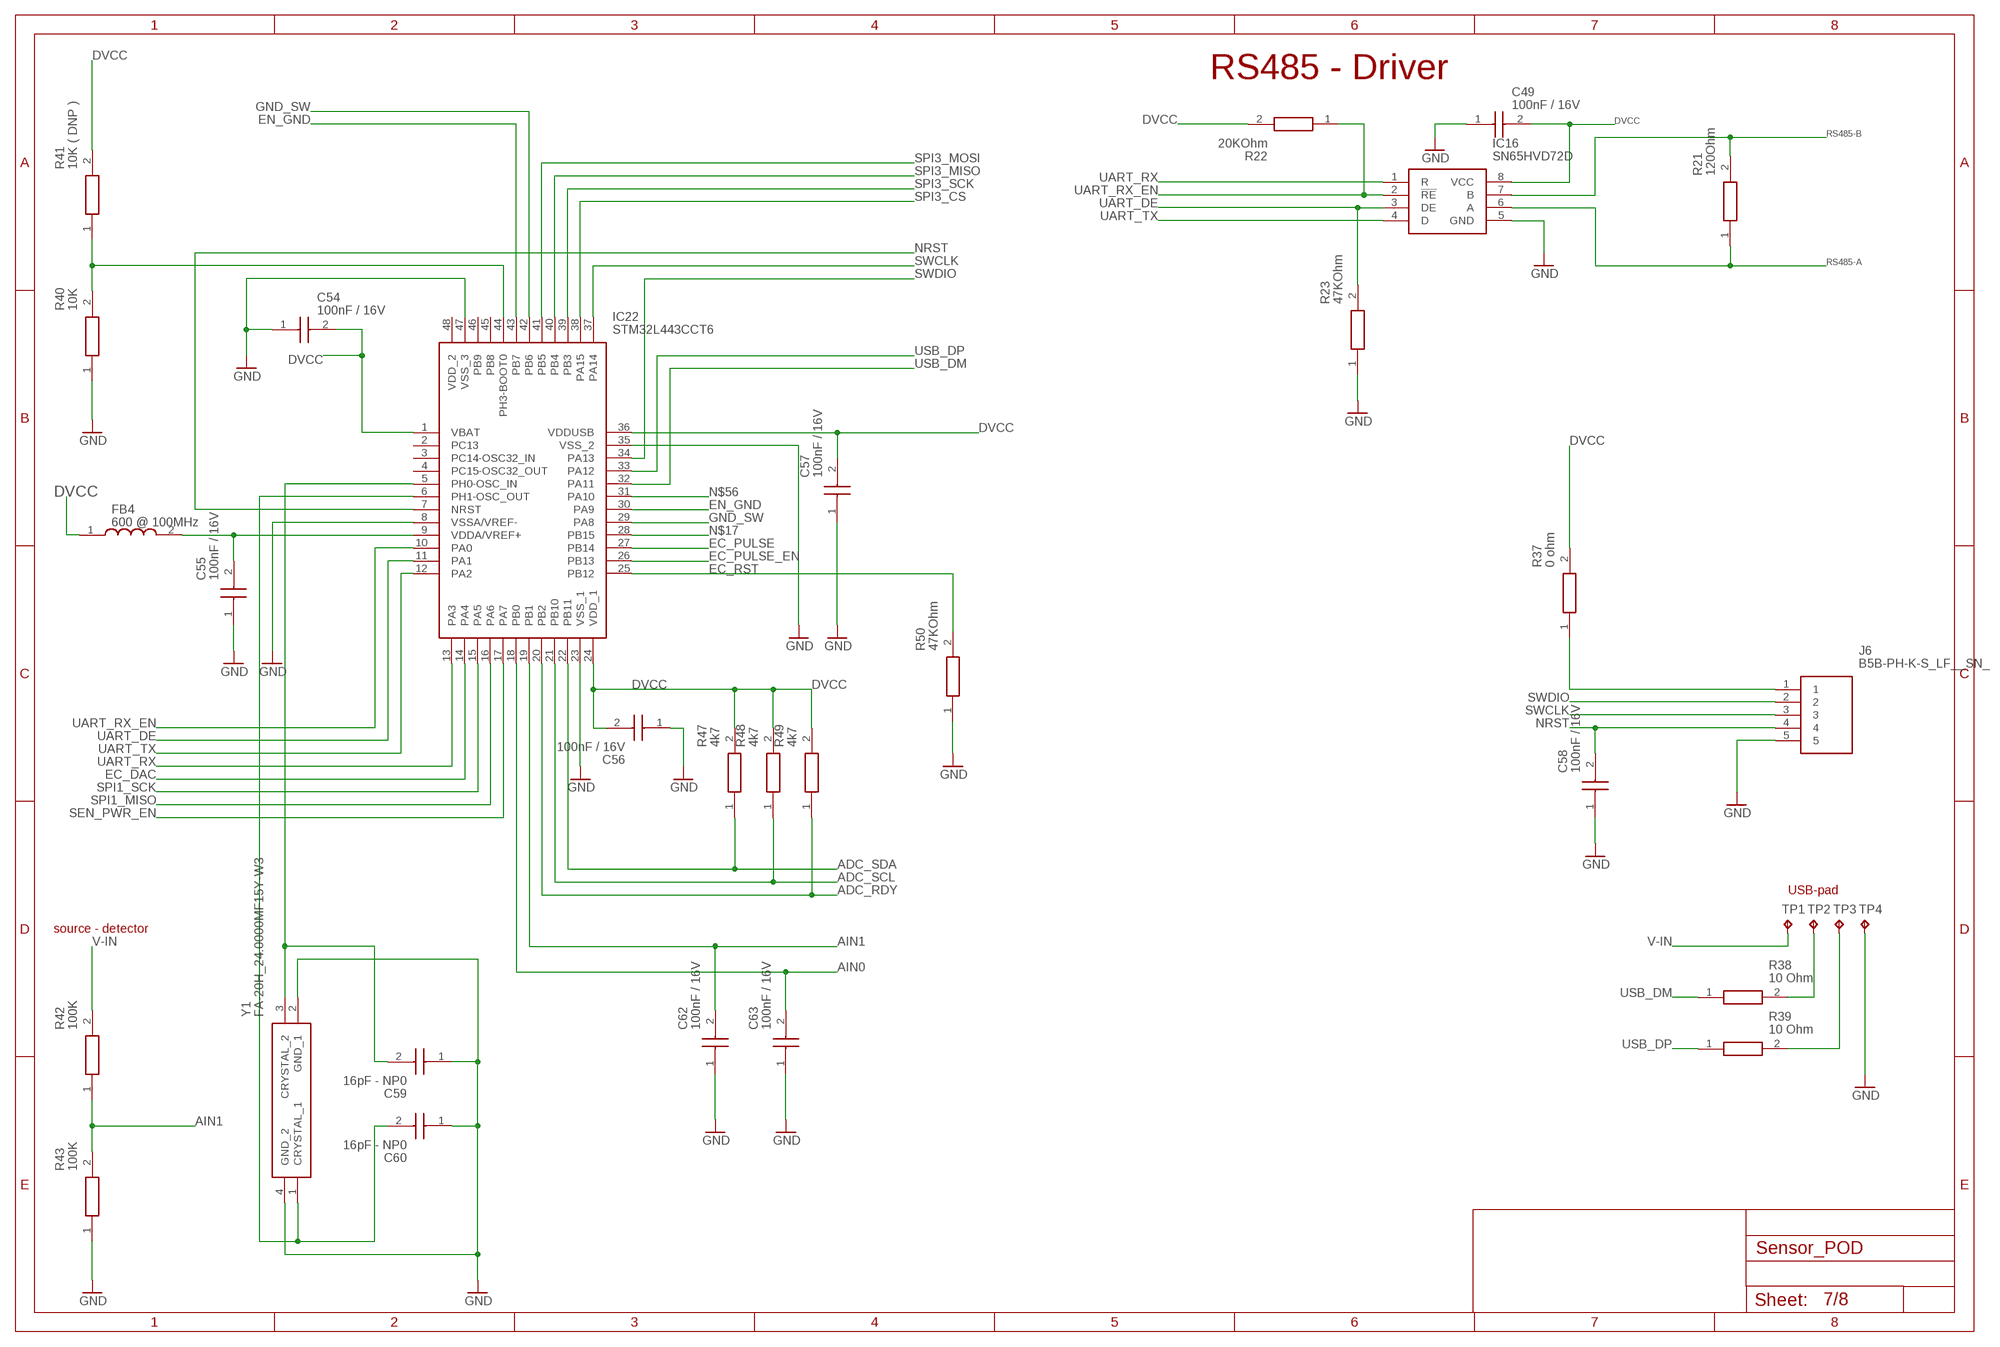
[diagram p6: schematic, sheet 7]

### Parts
C49  100nF / 16V  0603YC104JAT2A  [CAPC1608X90N]
C54  100nF / 16V  EMK107BJ104KAHT  [CAPC1608X90N@1]
C55  100nF / 16V  EMK107BJ104KAHT  [CAPC1608X90N@1]
C56  100nF / 16V  EMK107BJ104KAHT  [CAPC1608X90N@1]
C57  100nF / 16V  EMK107BJ104KAHT  [CAPC1608X90N@1]
C58  100nF / 16V  EMK107BJ104KAHT  [CAPC1608X90N@1]
C59  16pF - NP0  VJ0603A120KXCAC  [CAPC1608X97N]
C60  16pF - NP0  VJ0603A120KXCAC  [CAPC1608X97N]
C62  100nF / 16V  EMK107BJ104KAHT  [CAPC1608X90N@1]
C63  100nF / 16V  EMK107BJ104KAHT  [CAPC1608X90N@1]
FB4  600 @ 100MHz  MPZ1608S601ATA00  [BEADC1608X75N]
IC16  SN65HVD72D  [SOIC127P600X175-8N]
IC22  STM32L443CCT6  [QFP50P900X900X160-48N]
J6  B5B-PH-K-S_LF__SN_  [SHDR5W50P0X200_1X5_1190X450X60]
R21  120Ohm  ERJ-3RBD1200V  [RESC1608X55N@2]
R22  20KOhm  ERA3AED203V  [RESC1608X55N@2]
R23  47KOhm  RC0603JR-1047KL  [RESC1608X55N@2]
R37  0 ohm  RC0603FR-070RL  [RESC1608X55N@2]
R38  10 Ohm  RT0603FRD0710RL  [RESC1608X55N@2]
R39  10 Ohm  RT0603FRD0710RL  [RESC1608X55N@2]
R40  10K  ERA-3AEB103V  [RESC1608X55N@2]
R41  10K ( DNP )  ERA-3AEB103V  [RESC1608X55N@2]
R42  100K  RT0603DRE07100KL  [RESC1608X55N@1]
R43  100K  RT0603DRE07100KL  [RESC1608X55N@1]
R47  4k7  ERJ3RBD4701V  [RESC1608X55N]
R48  4k7  ERJ3RBD4701V  [RESC1608X55N]
R49  4k7  ERJ3RBD4701V  [RESC1608X55N]
R50  47KOhm  RC0603JR-1047KL  [RESC1608X55N@2]
TP1  TPB1,27  [B1,27]
TP2  TPB1,27  [B1,27]
TP3  TPB1,27  [B1,27]
TP4  TPB1,27  [B1,27]
Y1  FA-20H_24.0000MF15Y-W3  [FA20H160000MF12ZAC3]

### Nets
ADC_RDY: IC22.20(PB2) R49.1 ; also sheet 6
ADC_SCL: IC22.21(PB10) R48.1 ; also sheet 6
ADC_SDA: IC22.22(PB11) R47.1 ; also sheet 6
AIN0: C63.2 IC22.18(PB0) ; also sheet 2
AIN1: C62.2 IC22.19(PB1) R42.1 R43.2
DVCC: C49.2 C54.2 C56.2 C57.2 FB4.1 IC16.8(VCC) IC22.1(VBAT) IC22.24(VDD_1) IC22.36(VDDUSB) R22.2 R37.2 R41.2 R47.2 R48.2 R49.2 ; also sheet 1,2,3,4,5,6
EC_DAC: IC22.14(PA4) ; also sheet 4
EC_PULSE: IC22.27(PB14) ; also sheet 4
EC_PULSE_EN: IC22.26(PB13) ; also sheet 4
EC_RST: IC22.25(PB12) R50.2 ; also sheet 4
EN_GND: IC22.30(PA9) IC22.43(PB7) ; also sheet 1
GND: C49.1 C54.1 C55.1 C56.1 C57.1 C58.1 C59.1 C60.1 C62.1 C63.1 IC16.5(GND) IC22.8(VSSA/VREF-) IC22.23(VSS_1) IC22.35(VSS_2) IC22.47(VSS_3) J6.5 R23.1 R40.1 R43.1 R50.1 TP4.TP Y1.2(GND_1) Y1.4(GND_2) ; also sheet 2,3,5,6
GND_SW: IC22.29(PA8) IC22.42(PB6) ; also sheet 1
N$17: IC22.28(PB15)
N$23: IC22.44(PH3-BOOT0) R40.2 R41.1
N$24: J6.1 R37.1
N$41: R38.2 TP2.TP
N$42: R39.2 TP3.TP
N$43: C60.2 IC22.6(PH1-OSC_OUT) Y1.1(CRYSTAL_1)
N$49: C59.2 IC22.5(PH0-OSC_IN) Y1.3(CRYSTAL_2)
N$52: C55.2 FB4.2 IC22.9(VDDA/VREF+)
N$56: IC22.31(PA10)
NRST: C58.2 IC22.7(NRST) J6.4
RS485-A: IC16.6(A) R21.1 ; also sheet 2
RS485-B: IC16.7(B) R21.2 ; also sheet 2
SEN_PWR_EN: IC22.17(PA7) ; also sheet 2
SPI1_MISO: IC22.16(PA6) ; also sheet 5
SPI1_SCK: IC22.15(PA5) ; also sheet 5
SPI3_CS: IC22.38(PA15) ; also sheet 6
SPI3_MISO: IC22.40(PB4) ; also sheet 6
SPI3_MOSI: IC22.41(PB5) ; also sheet 6
SPI3_SCK: IC22.39(PB3) ; also sheet 6
SWCLK: IC22.37(PA14) J6.3
SWDIO: IC22.34(PA13) J6.2
UART_DE: IC16.3(DE) IC22.11(PA1) R23.2
UART_RX: IC16.1(R) IC22.13(PA3)
UART_RX_EN: IC16.2(!RE) IC22.10(PA0) R22.1
UART_TX: IC16.4(D) IC22.12(PA2)
USB_DM: IC22.32(PA11) R38.1
USB_DP: IC22.33(PA12) R39.1
V-IN: R42.2 TP1.TP ; also sheet 2
Unconnected: IC22.2(PC13) IC22.3(PC14-OSC32_IN) IC22.4(PC15-OSC32_OUT) IC22.45(PB8) IC22.46(PB9) IC22.48(VDD_2)

### Notes on the sheet
- RS485 - Driver
- USB-pad
- source - detector

## Sheet 8 of 8: Description
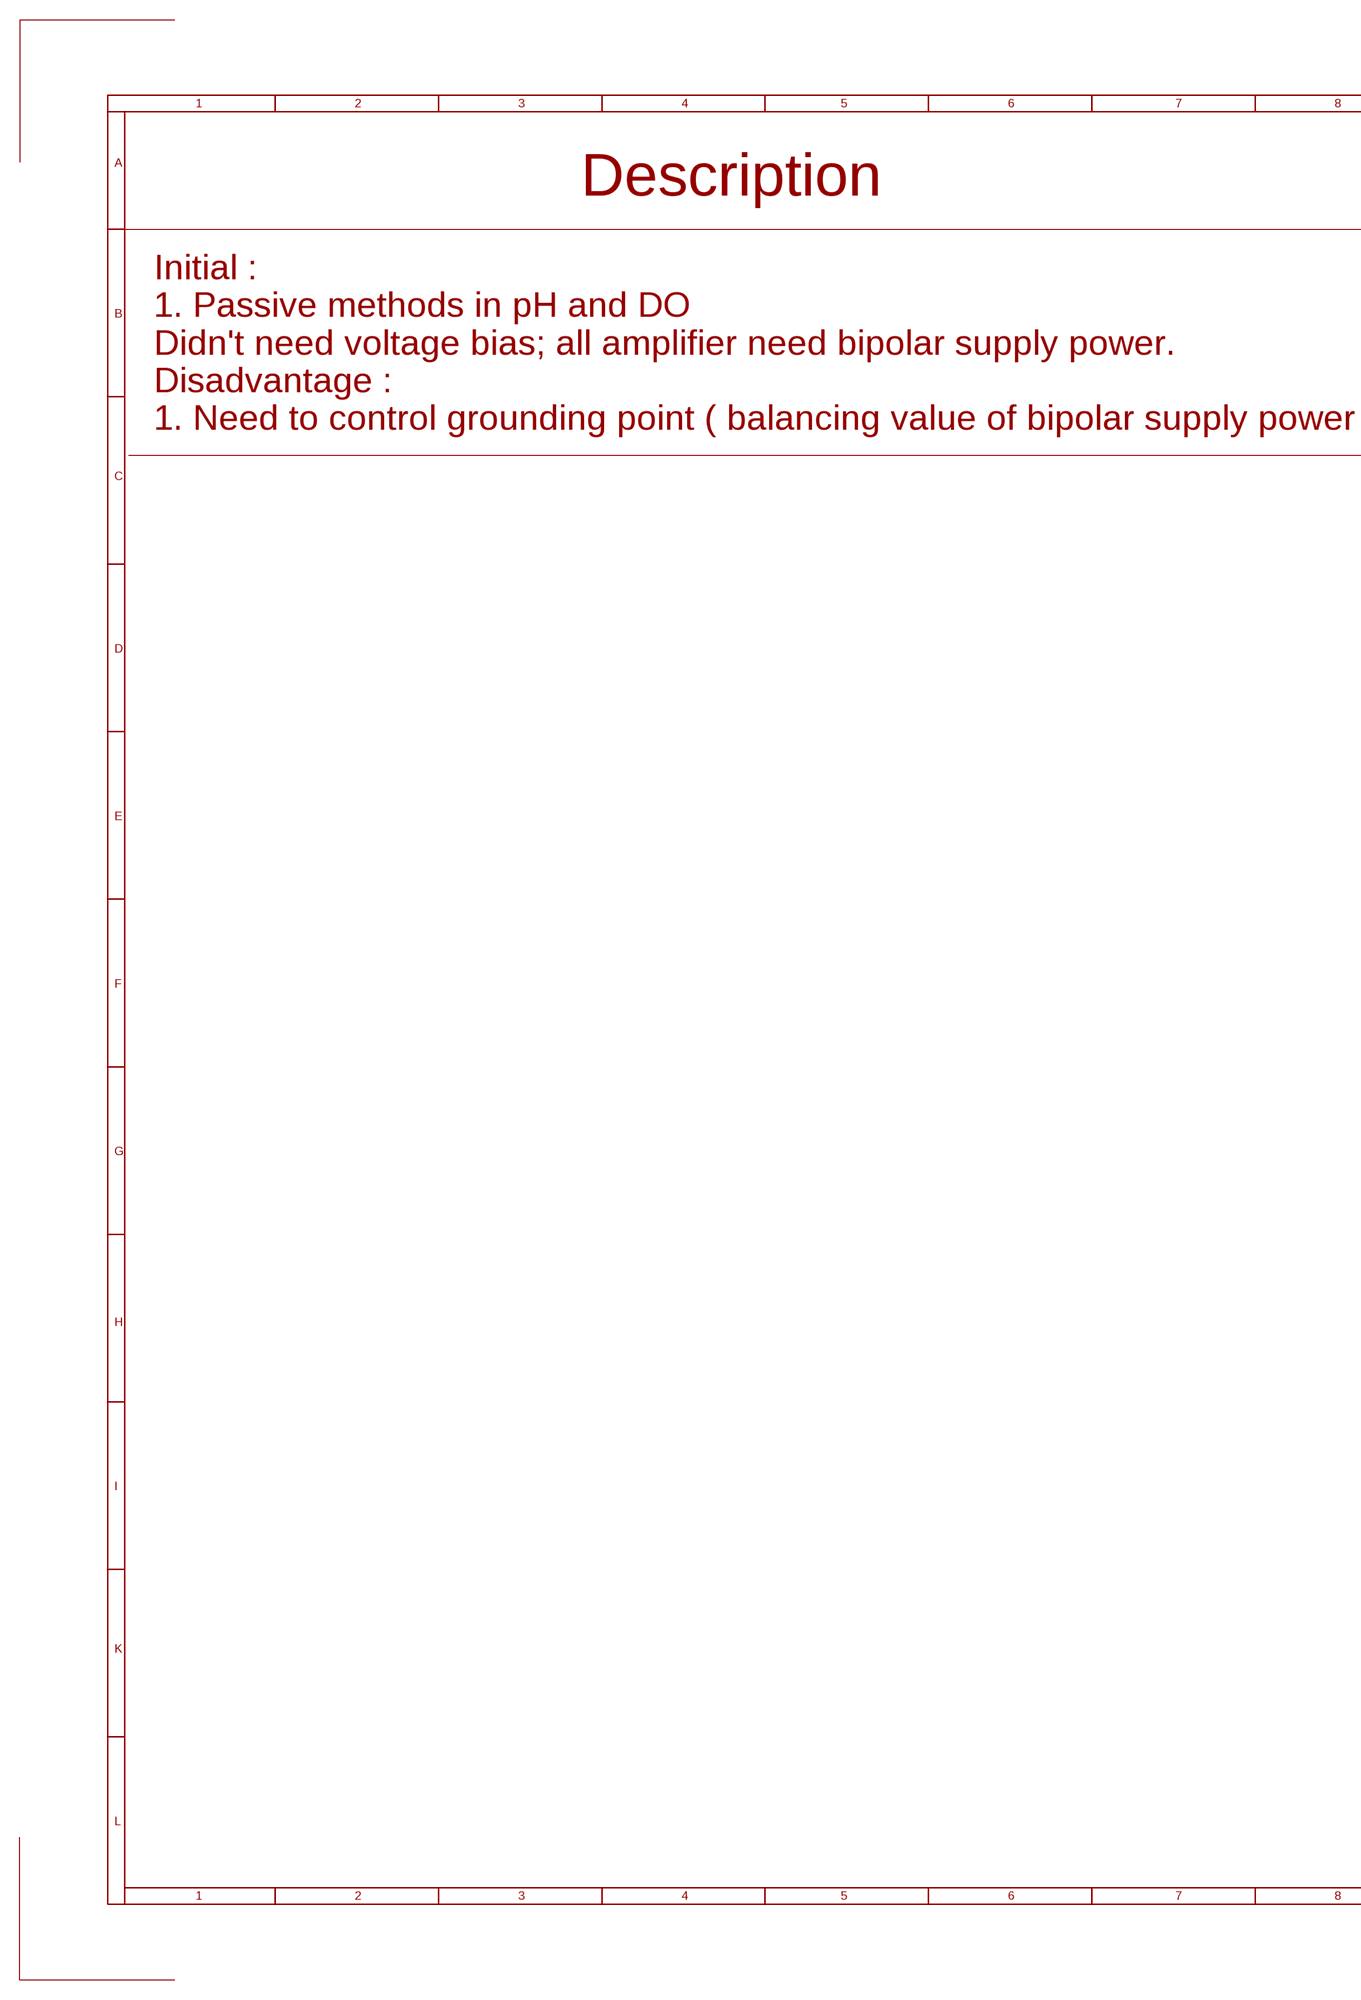
[diagram p7: schematic, sheet 8, part 1 of 2]
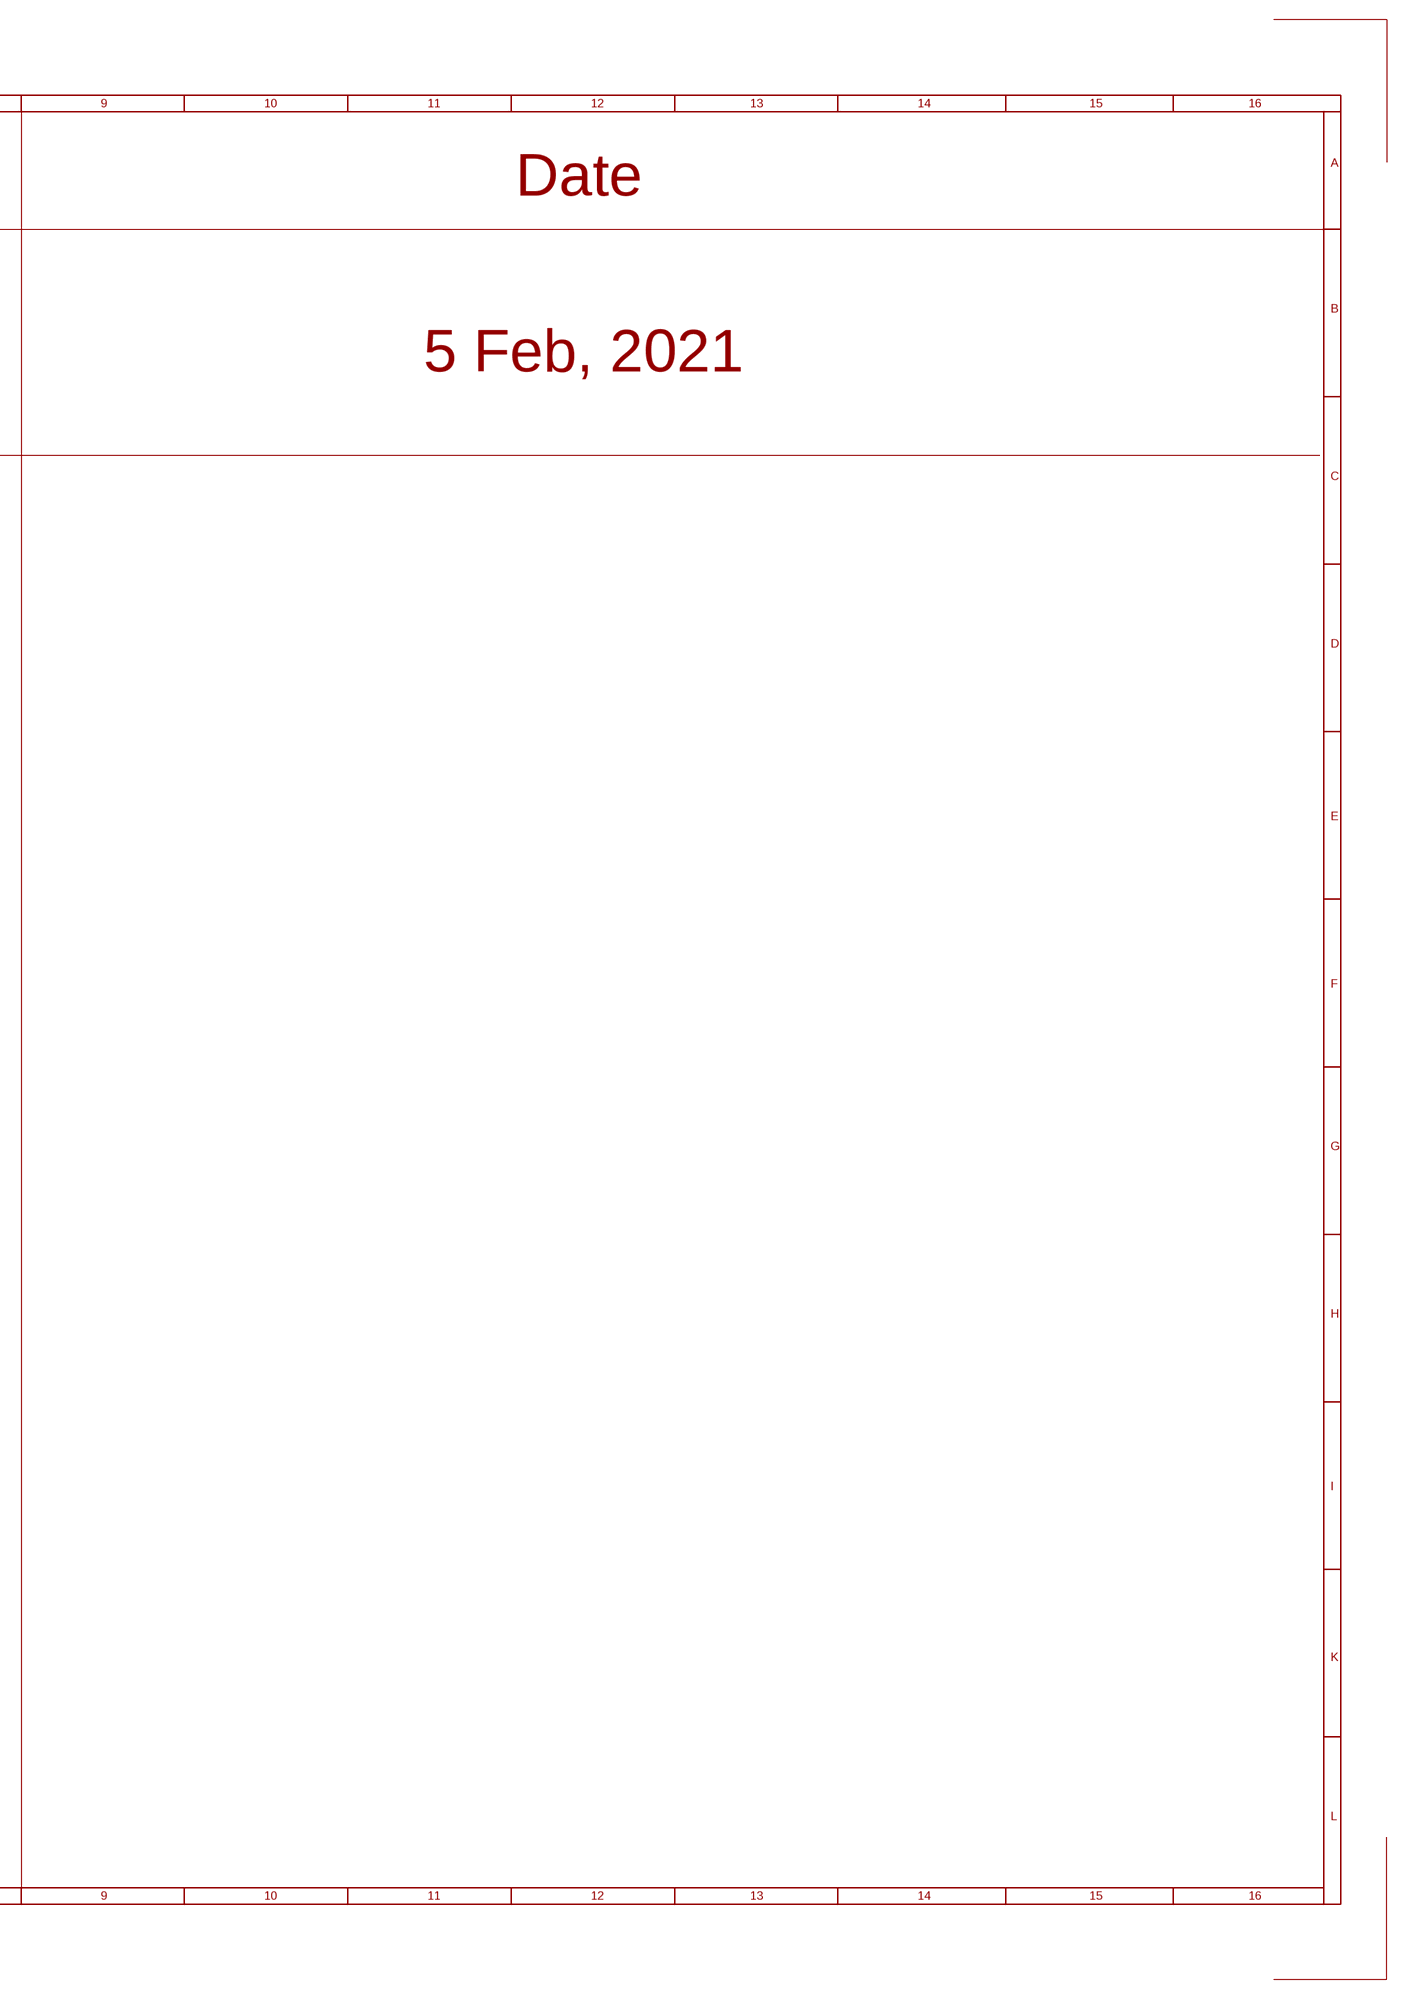
[diagram p8: schematic, sheet 8, part 2 of 2]

### Notes on the sheet
- Description | Date
- 5 Feb, 2021
- Initial : 
  1. Passive methods in pH and DO
  Didn't need voltage bias; all amplifier need bipolar supply power. 
  Disadvantage : 
  1. Need to control grounding point ( balancing value of bipolar supply power )

## Library data of the parts
C1 C2 C10 C51-C53 = Samacsys:0603YC105JAT2A: Multilayer Ceramic Capacitors MLCC - SMD/SMT 16volts 1uF 5% X7R 0603 SIZE Source: Datasheet <http://www.mouser.com/catalog/supplier/library/pdf/AVXSurfaceMountCeramic.pdf>; ARROW_PART_NUMBER: 0603YC105JAT2A; ARROW_PRICE-STOCK: https://www.arrow.com/en/products/0603yc105jat2a/avx; DESCRIPTION: Multilayer Ceramic Capacitors MLCC - SMD/SMT 16volts 1uF 5% X7R 0603 SIZE; HEIGHT: 0.9mm; MANUFACTURER_NAME: AVX; MANUFACTURER_PART_NUMBER: 0603YC105JAT2A; MOUSER_PART_NUMBER: 581-0603YC105JAT2A; MOUSER_PRICE-STOCK: https://www.mouser.co.uk/ProductDetail/AVX/0603YC105JAT2A/?qs=RCLU9o6%252BptxSjO%252BNXwzoBQ%3D%3D
C3-C9 C13-C18 C21-C28 C44 C45 C49 C50 C61 = Samacsys:0603YC104JAT2A: 0603 X7R ceramic capacitor, 100nF 16V AVX 0603 FlEXITERM 100nF Ceramic Multilayer Capacitor, 16 V dc X7R Dielectric ??5% SMD Source: Datasheet <http://datasheets.avx.com/X7RDielectric.pdf>; ARROW_PART_NUMBER: 0603YC104JAT2A; ARROW_PRICE-STOCK: https://www.arrow.com/en/products/0603yc104jat2a/avx; DESCRIPTION: 0603 X7R ceramic capacitor, 100nF 16V AVX 0603 FlEXITERM 100nF Ceramic Multilayer Capacitor, 16 V dc X7R Dielectric ??5% SMD; HEIGHT: 0.9mm; MANUFACTURER_NAME: AVX; MANUFACTURER_PART_NUMBER: 0603YC104JAT2A; MOUSER_PART_NUMBER: 581-0603YC104J; MOUSER_PRICE-STOCK: https://www.mouser.co.uk/ProductDetail/AVX/0603YC104JAT2A/?qs=sLCq1SyoLfFxJScN8MO4mA%3D%3D
C11 C12 C29 C39-C41 C43 = Samacsys:EMK107BBJ106MA-T: TAIYO YUDEN - EMK107BBJ106MA-T - CAPACITOR, MLCC, X5R, 10UF, 16V, 0603, REEL Source: Datasheet <https://altium.componentsearchengine.com/Datasheets/2/EMK107BBJ106MA-T.pdf>; DESCRIPTION: TAIYO YUDEN - EMK107BBJ106MA-T - CAPACITOR, MLCC, X5R, 10UF, 16V, 0603, REEL; HEIGHT: 1mm; MANUFACTURER_NAME: TAIYO YUDEN; MANUFACTURER_PART_NUMBER: EMK107BBJ106MA-T; MOUSER_PART_NUMBER: 963-EMK107BBJ106MA-T; MOUSER_PRICE-STOCK: https://www.mouser.co.uk/ProductDetail/Taiyo-Yuden/EMK107BBJ106MA-T?qs=%252BAZVS4b%2FkgLbAKVTp0R69Q%3D%3D
C19 = Samacsys:C0603C102J5GACTU: CAPACITOR, 0603 1nF +/-5% 50V Source: Datasheet <http://componentsearchengine.com/Datasheets/1/C0603C102J5GACTU.pdf>; DESCRIPTION: CAPACITOR, 0603 1nF +/-5% 50V; HEIGHT: mm; MANUFACTURER_NAME: Kemet; MANUFACTURER_PART_NUMBER: C0603C102J5GACTU; MOUSER_PART_NUMBER: 80-C0603C102J5G; MOUSER_PRICE-STOCK: https://www.mouser.com/Search/Refine.aspx?Keyword=80-C0603C102J5G
C20 C30 C31 = Samacsys:C0603C103J5RACTU: Kemet 0603 C 10nF Ceramic Multilayer Capacitor, 50 V, +125C, X7R Dielectric, +/-5% Source: Datasheet <https://componentsearchengine.com/Datasheets/2/C0603C103J5RACTU.pdf>; ARROW_PART_NUMBER: C0603C103J5RACTU; ARROW_PRICE-STOCK: https://www.arrow.com/en/products/c0603c103j5ractu/kemet-corporation; DESCRIPTION: Kemet 0603 C 10nF Ceramic Multilayer Capacitor, 50 V, +125C, X7R Dielectric, +/-5%; HEIGHT: 0.87mm; MANUFACTURER_NAME: Kemet; MANUFACTURER_PART_NUMBER: C0603C103J5RACTU; MOUSER_PART_NUMBER: 80-C0603C103J5R; MOUSER_PRICE-STOCK: https://www.mouser.co.uk/ProductDetail/KEMET/C0603C103J5RACTU/?qs=BimOss5pjlFJEfKhlb7g1g%3D%3D
C32 C35 = Samacsys:06033C473KAT2A: AVX 0603 Standard 47nF Ceramic Multilayer Capacitor, 25 V dc, +125C, X7R Dielectric, +/-10% SMD Source: Datasheet <https://componentsearchengine.com/Datasheets/1/06031A100FAT2A.pdf>; ARROW_PART_NUMBER: 06033C473KAT2A; ARROW_PRICE-STOCK: https://www.arrow.com/en/products/06033c473kat2a/avx; DESCRIPTION: AVX 0603 Standard 47nF Ceramic Multilayer Capacitor, 25 V dc, +125C, X7R Dielectric, +/-10% SMD; HEIGHT: 0.9mm; MANUFACTURER_NAME: AVX; MANUFACTURER_PART_NUMBER: 06033C473KAT2A; MOUSER_PART_NUMBER: 581-06033C473K; MOUSER_PRICE-STOCK: https://www.mouser.co.uk/ProductDetail/AVX/06033C473KAT2A/?qs=3%2FS8Ftzo4%2FqpasAmPoSYfg%3D%3D
C33 C36 = Samacsys:TMK107B7105KA-T: Multilayer Ceramic Capacitors MLCC - SMD/SMT 0603 25V 1uF 10% X7R Source: Datasheet <https://componentsearchengine.com/Datasheets/1/TMK107B7105KA-T.pdf>; DESCRIPTION: Multilayer Ceramic Capacitors MLCC - SMD/SMT 0603 25V 1uF 10% X7R; HEIGHT: 0.9mm; MANUFACTURER_NAME: TAIYO YUDEN; MANUFACTURER_PART_NUMBER: TMK107B7105KA-T; MOUSER_PART_NUMBER: 963-TMK107B7105KA-T; MOUSER_PRICE-STOCK: https://www.mouser.co.uk/ProductDetail/Taiyo-Yuden/TMK107B7105KA-T/?qs=PzICbMaShUfoHRKdwm1IMg%3D%3D
C34 C37 = Samacsys:CL10B225KP8NFNC: CAP CER 2.2UF 10V X7R 0603 Source: Datasheet <http://www.samsungsem.com/kr/support/product-search/mlcc/__icsFiles/afieldfile/2016/08/18/S_CL10B225KP8NFNC.pdf>; ARROW_PART_NUMBER: CL10B225KP8NFNC; ARROW_PRICE-STOCK: https://www.arrow.com/en/products/cl10b225kp8nfnc/samsung-electro-mechanics; DESCRIPTION: CAP CER 2.2UF 10V X7R 0603; HEIGHT: 0.9mm; MANUFACTURER_NAME: Samsung Electro-Mechanics; MANUFACTURER_PART_NUMBER: CL10B225KP8NFNC; MOUSER_PART_NUMBER: 187-CL10B225KP8NFNC; MOUSER_PRICE-STOCK: https://www.mouser.co.uk/ProductDetail/Samsung-Electro-Mechanics/CL10B225KP8NFNC/?qs=%252B6g0mu59x7IZNwS%252B4osryA%3D%3D
C38 C54-C58 C62 C63 = Samacsys:EMK107BJ104KAHT: Multilayer Ceramic Capacitors MLCC - SMD/SMT 0.1uF 16V X5R +/-10% 0603 AEC-Q200 Source: Datasheet <https://rs.componentsearchengine.com/Datasheets/1/EMK107BJ104KAHT.pdf>; DESCRIPTION: Multilayer Ceramic Capacitors MLCC - SMD/SMT 0.1uF 16V X5R +/-10% 0603 AEC-Q200; HEIGHT: 0.9mm; MANUFACTURER_NAME: TAIYO YUDEN; MANUFACTURER_PART_NUMBER: EMK107BJ104KAHT; MOUSER_PART_NUMBER: 963-EMK107BJ104KAHT; MOUSER_PRICE-STOCK: https://www.mouser.co.uk/ProductDetail/Taiyo-Yuden/EMK107BJ104KAHT?qs=CNQs48zzdnoELjxZCQMTEQ%3D%3D
C42 = Samacsys:CGA3E2X5R1E224K080AA: TDK 220nF Multilayer Ceramic Capacitor MLCC 25 V dc +/-10% X5R Dielectric 1608 Solder Max. Op. Temp. +85C Source: Datasheet <http://docs-emea.rs-online.com/webdocs/14e9/0900766b814e9125.pdf>; ARROW_PART_NUMBER: CGA3E2X5R1E224K080AA; ARROW_PRICE-STOCK: https://www.arrow.com/en/products/cga3e2x5r1e224k080aa/tdk; DESCRIPTION: TDK 220nF Multilayer Ceramic Capacitor MLCC 25 V dc +/-10% X5R Dielectric 1608 Solder Max. Op. Temp. +85C; HEIGHT: 0.9mm; MANUFACTURER_NAME: TDK; MANUFACTURER_PART_NUMBER: CGA3E2X5R1E224K080AA; MOUSER_PART_NUMBER: 810-CGA3E2X5R1E224KA; MOUSER_PRICE-STOCK: https://www.mouser.co.uk/ProductDetail/TDK/CGA3E2X5R1E224K080AA/?qs=xLDY6iXSiQbeSTNpGdSLFA%3D%3D
C46-C48 = Samacsys:GRM188R61E474KA12D: Ceramic SMT capacitor 470nF 25Vdc Murata 0603 GRM 470nF Ceramic Multilayer Capacitor, 25 V dc, +85degC, X5R Dielectric, /-10% Source: Datasheet <http://psearch.en.murata.com/capacitor/product/GRM188R61E474KA12#.pdf>; ARROW_PART_NUMBER: GRM188R61E474KA12D; ARROW_PRICE-STOCK: https://www.arrow.com/en/products/grm188r61e474ka12d/murata-manufacturing; DESCRIPTION: Ceramic SMT capacitor 470nF 25Vdc Murata 0603 GRM 470nF Ceramic Multilayer Capacitor, 25 V dc, +85degC, X5R Dielectric, /-10%; HEIGHT: 0.9mm; MANUFACTURER_NAME: Murata Electronics; MANUFACTURER_PART_NUMBER: GRM188R61E474KA12D; MOUSER_PART_NUMBER: 81-GRM188R61E474KA2D; MOUSER_PRICE-STOCK: https://www.mouser.com/Search/Refine.aspx?Keyword=81-GRM188R61E474KA2D
C59 C60 = Samacsys:VJ0603A120KXCAC: Multilayer Ceramic Capacitors MLCC - SMD/SMT Source: Datasheet <http://www.vishay.com/docs/45226/vj31xrohsautomlcc.pdf>; DESCRIPTION: Multilayer Ceramic Capacitors MLCC - SMD/SMT; HEIGHT: 0.97mm; MANUFACTURER_NAME: Vishay; MANUFACTURER_PART_NUMBER: VJ0603A120KXCAC; MOUSER_PART_NUMBER: N/A; MOUSER_PRICE-STOCK: https://www.mouser.co.uk/ProductDetail/Vishay-Vitramon/VJ0603A120KXCAC?qs=WQ%252BUh87gux%2F%2FnT6KKstV%252BA%3D%3D
D1 = Samacsys:FDLL914B: Diodes - General Purpose, Power, Switching Small Signal Diode Source: Datasheet <https://www.onsemi.com/pub/Collateral/1N914-D.PDF>; ARROW_PART_NUMBER: FDLL914B; ARROW_PRICE-STOCK: https://www.arrow.com/en/products/fdll914b/on-semiconductor; DESCRIPTION: Diodes - General Purpose, Power, Switching Small Signal Diode; HEIGHT: 1.7mm; MANUFACTURER_NAME: ON Semiconductor; MANUFACTURER_PART_NUMBER: FDLL914B; MOUSER_PART_NUMBER: 512-FDLL914B; MOUSER_PRICE-STOCK: https://www.mouser.co.uk/ProductDetail/ON-Semiconductor-Fairchild/FDLL914B?qs=9SkZ1U%2FfS5xQ%2FMNH4cvGmg%3D%3D
FB1 = Samacsys:BLM18KG102SH1D: BLM18_H1D Series EMI Suppression Filter 1000+/-25% at 100MHz 1A @85 Source: Datasheet <https://www.murata.com/en-us/products/productdetail?partno=BLM18KG102SH1#>; ARROW_PART_NUMBER: BLM18KG102SH1D; ARROW_PRICE-STOCK: https://www.arrow.com/en/products/blm18kg102sh1d/murata-manufacturing; DESCRIPTION: BLM18_H1D Series EMI Suppression Filter 1000+/-25% at 100MHz 1A @85; HEIGHT: 0.95mm; MANUFACTURER_NAME: Murata Electronics; MANUFACTURER_PART_NUMBER: BLM18KG102SH1D; MOUSER_PART_NUMBER: 81-BLM18KG102SH1D; MOUSER_PRICE-STOCK: https://www.mouser.co.uk/ProductDetail/Murata-Electronics/BLM18KG102SH1D?qs=0lQeLiL1qyYL39c9eT84hA%3D%3D
FB2-FB4 = Samacsys:MPZ1608S601ATA00: TDK - MPZ1608S601ATA00 - FERRITE BEAD, 0.15OHM, 1A, 0603 Source: Datasheet <https://componentsearchengine.com/Datasheets/2/MPZ1608S601ATA00.pdf>; ARROW_PART_NUMBER: MPZ1608S601ATA00; ARROW_PRICE-STOCK: https://www.arrow.com/en/products/mpz1608s601ata00/tdk; DESCRIPTION: TDK - MPZ1608S601ATA00 - FERRITE BEAD, 0.15OHM, 1A, 0603; HEIGHT: 0.75mm; MANUFACTURER_NAME: TDK; MANUFACTURER_PART_NUMBER: MPZ1608S601ATA00; MOUSER_PART_NUMBER: 810-MPZ1608S601ATA00; MOUSER_PRICE-STOCK: https://www.mouser.co.uk/ProductDetail/TDK/MPZ1608S601ATA00/?qs=47dIwT2ZIzth0CTKDYh9rw%3D%3D
IC1 IC2 = Samacsys:LPV811DBVR: Single Channel 450nA Precision Nanopower Operational Amplifier Source: Datasheet <http://www.ti.com/lit/gpn/lpv811>; ARROW_PART_NUMBER: LPV811DBVR; ARROW_PRICE-STOCK: https://www.arrow.com/en/products/lpv811dbvr/texas-instruments; DESCRIPTION: Single Channel 450nA Precision Nanopower Operational Amplifier; HEIGHT: 1.45mm; MANUFACTURER_NAME: Texas Instruments; MANUFACTURER_PART_NUMBER: LPV811DBVR; MOUSER_PART_NUMBER: 595-LPV811DBVR; MOUSER_PRICE-STOCK: https://www.mouser.co.uk/ProductDetail/Texas-Instruments/LPV811DBVR?qs=Bho%2FbeBaDEw7Lz2bc16D2A%3D%3D
IC3 IC19 = Samacsys:MAX4660EUA+T: Analog Switch ICs High-Current, 25Ohm, SPDT, CMOS Analog Switches Source: Datasheet <https://pdfserv.maximintegrated.com/en/ds/MAX4659-MAX4660.pdf>; DESCRIPTION: Analog Switch ICs High-Current, 25Ohm, SPDT, CMOS Analog Switches; HEIGHT: 1.1mm; MANUFACTURER_NAME: Maxim Integrated; MANUFACTURER_PART_NUMBER: MAX4660EUA+T; MOUSER_PART_NUMBER: 700-MAX4660EUA+T; MOUSER_PRICE-STOCK: https://www.mouser.co.uk/ProductDetail/Maxim-Integrated/MAX4660EUA%2bT/?qs=LHmEVA8xxfYWyoG6EEMOxw%3D%3D
IC5 = Samacsys:ADS1115BQDGSRQ1: Automotive 16-Bit 860SPS 4-Ch Delta-Sigma ADC With PGA, Oscillator, VREF, Comparator, and I2C Source: Datasheet <http://www.ti.com/lit/gpn/ads1115-q1>; ARROW_PART_NUMBER: ADS1115BQDGSRQ1; ARROW_PRICE-STOCK: https://www.arrow.com/en/products/ads1115bqdgsrq1/texas-instruments; DESCRIPTION: Automotive 16-Bit 860SPS 4-Ch Delta-Sigma ADC With PGA, Oscillator, VREF, Comparator, and I2C; HEIGHT: 1.1mm; MANUFACTURER_NAME: Texas Instruments; MANUFACTURER_PART_NUMBER: ADS1115BQDGSRQ1; MOUSER_PART_NUMBER: 595-ADS1115BQDGSRQ1; MOUSER_PRICE-STOCK: https://www.mouser.co.uk/ProductDetail/Texas-Instruments/ADS1115BQDGSRQ1/?qs=34RfhUjJmKdvyLrkbnfjHA%3D%3D
IC6 = Samacsys:PGA280AIPW: Texas Instruments,PGA280AIPW,IC,Amp PGA280AIPW, Instrumentation Amplifier, 250 Source: Datasheet <http://docs-emea.rs-online.com/webdocs/1304/0900766b81304ed6.pdf>; ARROW_PART_NUMBER: PGA280AIPW; ARROW_PRICE-STOCK: https://www.arrow.com/en/products/pga280aipw/texas-instruments; DESCRIPTION: Texas Instruments,PGA280AIPW,IC,Amp PGA280AIPW, Instrumentation Amplifier, 250; HEIGHT: 1.2mm; MANUFACTURER_NAME: Texas Instruments; MANUFACTURER_PART_NUMBER: PGA280AIPW; MOUSER_PART_NUMBER: 595-PGA280AIPW; MOUSER_PRICE-STOCK: https://www.mouser.com/Search/Refine.aspx?Keyword=595-PGA280AIPW
IC7 IC14 = Samacsys:TPS73433DDCR: 250mA, Low Quiescent Current, Ultra-Low Noise, High PSRR, Low-Dropout Linear Regulator Source: Datasheet <http://www.ti.com/lit/gpn/TPS734>; ARROW_PART_NUMBER: TPS73433DDCR; ARROW_PRICE-STOCK: https://www.arrow.com/en/products/tps73433ddcr/texas-instruments; DESCRIPTION: 250mA, Low Quiescent Current, Ultra-Low Noise, High PSRR, Low-Dropout Linear Regulator; HEIGHT: 1.1mm; MANUFACTURER_NAME: Texas Instruments; MANUFACTURER_PART_NUMBER: TPS73433DDCR; MOUSER_PART_NUMBER: 595-TPS73433DDCR; MOUSER_PRICE-STOCK: https://www.mouser.co.uk/ProductDetail/Texas-Instruments/TPS73433DDCR/?qs=zkOrf9mfN89IGlRgr2dthg%3D%3D
IC8 = Samacsys:OPA322AIDBVR: 20MHz Low-Noise 1.8V RRIO CMOS Operational Amplifier With Shutdown Source: Datasheet <http://www.ti.com/lit/gpn/opa322>; ARROW_PART_NUMBER: OPA322AIDBVR; ARROW_PRICE-STOCK: https://www.arrow.com/en/products/opa322aidbvr/texas-instruments; DESCRIPTION: 20MHz Low-Noise 1.8V RRIO CMOS Operational Amplifier With Shutdown; HEIGHT: 1.45mm; MANUFACTURER_NAME: Texas Instruments; MANUFACTURER_PART_NUMBER: OPA322AIDBVR; MOUSER_PART_NUMBER: 595-OPA322AIDBVR; MOUSER_PRICE-STOCK: https://www.mouser.co.uk/ProductDetail/Texas-Instruments/OPA322AIDBVR/?qs=Gia6%252BsTQdYOijwIgbb0dDg%3D%3D
IC9 = Samacsys:INA333AIDGKR: Low-Power, Zero-Drift, Precision Instrumentation Amplifier Source: Datasheet <http://www.ti.com/lit/ds/symlink/ina333.pdf>; ARROW_PART_NUMBER: INA333AIDGKR; ARROW_PRICE-STOCK: https://www.arrow.com/en/products/ina333aidgkr/texas-instruments; DESCRIPTION: Low-Power, Zero-Drift, Precision Instrumentation Amplifier; HEIGHT: 1.1mm; MANUFACTURER_NAME: Texas Instruments; MANUFACTURER_PART_NUMBER: INA333AIDGKR; MOUSER_PART_NUMBER: 595-INA333AIDGKR; MOUSER_PRICE-STOCK: https://www.mouser.co.uk/ProductDetail/Texas-Instruments/INA333AIDGKR/?qs=nJRxFdq%252BlvaKwfZOdHFpKg%3D%3D
IC10 = Samacsys:OPA333AIDCKTG4: TEXAS INSTRUMENTS - OPA333AIDCKTG4 . - Operational Amplifier, Single, 1 Amplifier, 350 kHz, 0.16 V/?s, 1.8V to 5.5V, SC-70, 5 Pins Source: Datasheet <https://www.ti.com/lit/ds/symlink/opa333.pdf?ts=1588316579159>; ARROW_PART_NUMBER: OPA333AIDCKTG4; ARROW_PRICE-STOCK: https://www.arrow.com/en/products/opa333aidcktg4/texas-instruments; DESCRIPTION: TEXAS INSTRUMENTS - OPA333AIDCKTG4 . - Operational Amplifier, Single, 1 Amplifier, 350 kHz, 0.16 V/?s, 1.8V to 5.5V, SC-70, 5 Pins; HEIGHT: 1.1mm; MANUFACTURER_NAME: Texas Instruments; MANUFACTURER_PART_NUMBER: OPA333AIDCKTG4; MOUSER_PART_NUMBER: 595-OPA333AIDCKTG4; MOUSER_PRICE-STOCK: https://www.mouser.co.uk/ProductDetail/Texas-Instruments/OPA333AIDCKTG4?qs=yUv0o6iPc2S1x2j3KBz9uQ%3D%3D
IC11 IC21 = Samacsys:MAX4564EUA+: MAX4564EUA+ Maxim, Analogue Switch Single SPDT, 8-Pin MAX Source: Datasheet <https://datasheets.maximintegrated.com/en/ds/MAX4564.pdf>; DESCRIPTION: MAX4564EUA+ Maxim, Analogue Switch Single SPDT, 8-Pin MAX; HEIGHT: 1.1mm; MANUFACTURER_NAME: Maxim Integrated; MANUFACTURER_PART_NUMBER: MAX4564EUA+; MOUSER_PART_NUMBER: 700-MAX4564EUA; MOUSER_PRICE-STOCK: https://www.mouser.co.uk/ProductDetail/Maxim-Integrated/MAX4564EUA%2b/?qs=1THa7WoU59EB4DrLbIjpjA%3D%3D
IC12 = linear:OPA2107: OP AMP
IC13 = Samacsys:OPA187IDBVR: Operational Amplifiers - Op Amps 1uV Vos, 0.005uV/C, Rail-to-Rail Output, Low-Power 36V Zero-Drift Operational Amplifier 5-SOT-23 -40 to 125 Source: Datasheet <http://www.ti.com/lit/ds/symlink/opa187.pdf>; ARROW_PART_NUMBER: OPA187IDBVR; ARROW_PRICE-STOCK: https://www.arrow.com/en/products/opa187idbvr/texas-instruments; DESCRIPTION: Operational Amplifiers - Op Amps 1uV Vos, 0.005uV/C, Rail-to-Rail Output, Low-Power 36V Zero-Drift Operational Amplifier 5-SOT-23 -40 to 125; HEIGHT: 1.45mm; MANUFACTURER_NAME: Texas Instruments; MANUFACTURER_PART_NUMBER: OPA187IDBVR; MOUSER_PART_NUMBER: 595-OPA187IDBVR; MOUSER_PRICE-STOCK: https://www.mouser.co.uk/ProductDetail/Texas-Instruments/OPA187IDBVR/?qs=lc2O%252BfHJPVY%2FmlWbkjcZ%252BQ%3D%3D
IC15 = Samacsys:REG71050DDCR: 60-mA, 5.0-V, Buck/Boost Charge Pump in ThinSOT-23 Source: Datasheet <http://www.ti.com/lit/gpn/REG71050>; ARROW_PART_NUMBER: REG71050DDCR; ARROW_PRICE-STOCK: https://www.arrow.com/en/products/reg71050ddcr/texas-instruments; DESCRIPTION: 60-mA, 5.0-V, Buck/Boost Charge Pump in ThinSOT-23; HEIGHT: 1.1mm; MANUFACTURER_NAME: Texas Instruments; MANUFACTURER_PART_NUMBER: REG71050DDCR; MOUSER_PART_NUMBER: 595-REG71050DDCR; MOUSER_PRICE-STOCK: https://www.mouser.co.uk/ProductDetail/Texas-Instruments/REG71050DDCR?qs=sSOk4GDDv7w%2FF3O8izAevQ%3D%3D
IC16 = Samacsys:SN65HVD72D: 3.3 V Half-Duplex RS-485 with IEC ESD, 250 kbps Source: Datasheet <http://www.ti.com/lit/gpn/sn65hvd72>; ARROW_PART_NUMBER: SN65HVD72D; ARROW_PRICE-STOCK: https://www.arrow.com/en/products/sn65hvd72d/texas-instruments; DESCRIPTION: 3.3 V Half-Duplex RS-485 with IEC ESD, 250 kbps; HEIGHT: 1.75mm; MANUFACTURER_NAME: Texas Instruments; MANUFACTURER_PART_NUMBER: SN65HVD72D; MOUSER_PART_NUMBER: 595-SN65HVD72D; MOUSER_PRICE-STOCK: https://www.mouser.co.uk/ProductDetail/Texas-Instruments/SN65HVD72D/?qs=umApKWeh9pW%2FHHD2rvNVAg%3D%3D
IC18 = Samacsys:MAX11212AEUB+: MAX11212AEUB+, 18 bit ADC Differential, Serial, 10-Pin uMAX Source: Datasheet <http://docs-emea.rs-online.com/webdocs/1253/0900766b812530b8.pdf>; DESCRIPTION: MAX11212AEUB+, 18 bit ADC Differential, Serial, 10-Pin uMAX; HEIGHT: 1.1mm; MANUFACTURER_NAME: Maxim Integrated; MANUFACTURER_PART_NUMBER: MAX11212AEUB+; MOUSER_PART_NUMBER: 700-MAX11212AEUB+; MOUSER_PRICE-STOCK: https://www.mouser.co.uk/ProductDetail/Maxim-Integrated/MAX11212AEUB%2b?qs=mzcOS1kGbgfUBSQ9RlyOlQ%3D%3D
IC20 = Samacsys:LM2664M6_NOPB: 1.8V to 5.5Vin Switched Capacitor Voltage Converter Source: Datasheet <http://docs-emea.rs-online.com/webdocs/06e8/0900766b806e83f3.pdf>; ARROW_PART_NUMBER: LM2664M6/NOPB; ARROW_PRICE-STOCK: https://www.arrow.com/en/products/lm2664m6nopb/texas-instruments; DESCRIPTION: 1.8V to 5.5Vin Switched Capacitor Voltage Converter; HEIGHT: 1.45mm; MANUFACTURER_NAME: Texas Instruments; MANUFACTURER_PART_NUMBER: LM2664M6/NOPB; MOUSER_PART_NUMBER: 926-LM2664M6/NOPB; MOUSER_PRICE-STOCK: https://www.mouser.co.uk/ProductDetail/Texas-Instruments/LM2664M6-NOPB/?qs=X1J7HmVL2ZFqN%2Fb7EAhtIA%3D%3D
IC22 = Samacsys:STM32L443CCT6: STMICROELECTRONICS - STM32L443CCT6 - ARM MCU, STM32 Family STM32L4 Series Microcontrollers, ARM Cortex-M4, 32bit, 80 MHz, 256 KB, 64 KB Source: Datasheet <https://componentsearchengine.com/Datasheets/2/STM32L443CCT6.pdf>; ARROW_PART_NUMBER: STM32L443CCT6; ARROW_PRICE-STOCK: https://www.arrow.com/en/products/stm32l443cct6/stmicroelectronics; DESCRIPTION: STMICROELECTRONICS - STM32L443CCT6 - ARM MCU, STM32 Family STM32L4 Series Microcontrollers, ARM Cortex-M4, 32bit, 80 MHz, 256 KB, 64 KB; HEIGHT: 1.6mm; MANUFACTURER_NAME: STMicroelectronics; MANUFACTURER_PART_NUMBER: STM32L443CCT6; MOUSER_PART_NUMBER: 511-STM32L443CCT6; MOUSER_PRICE-STOCK: https://www.mouser.co.uk/ProductDetail/STMicroelectronics/STM32L443CCT6/?qs=dTJS0cRn7ohLPtZ3IeJ%2Fbg%3D%3D
J1 J2 J4 J5 = B2B-PH-K-S_LF__SN_:B2B-PH-K-S(LF)(SN): PH Series 2 Position 2 mm Pitch Through Hole Top Entry Shrouded Header Check prices <https://pricing.snapeda.com/parts/B2B-PH-K-S%28LF%29%28SN%29/JST%20Sales/view-part?ref=eda>; AVAILABILITY: Warning; DESCRIPTION: Connector Header Through Hole 2 position 0.079 (2.00mm); MF: JST Sales; MP: B2B-PH-K-S(LF)(SN); PACKAGE: None; PRICE: None
J3 = Samacsys:B4B-PH-K-S_LF__SN_: PH-2.0mm Header top entry 4 way JST PH Series, Series Number B4B, 2mm Pitch 4 Way 1 Row Straight PCB Header, Through Hole Termination, 2A Source: Datasheet <http://docs-emea.rs-online.com/webdocs/1347/0900766b81347511.pdf>; ARROW_PART_NUMBER: B4B-PH-K-S(LF)(SN); ARROW_PRICE-STOCK: https://www.arrow.com/en/products/b4b-ph-k-s-lf-sn/jst-manufacturing; DESCRIPTION: PH-2.0mm Header top entry 4 way JST PH Series, Series Number B4B, 2mm Pitch 4 Way 1 Row Straight PCB Header, Through Hole Termination, 2A; HEIGHT: 6mm; MANUFACTURER_NAME: JST (JAPAN SOLDERLESS TERMINALS); MANUFACTURER_PART_NUMBER: B4B-PH-K-S(LF)(SN)
J6 = Samacsys:B5B-PH-K-S_LF__SN_: PH-2.0mm Header top entry 5 way JST PH Series, Series Number B5B, 2mm Pitch 5 Way 1 Row Straight PCB Header, Through Hole Termination, 2A Source: Datasheet <http://uk.rs-online.com/web/p/products/8201438>; ARROW_PART_NUMBER: B5B-PH-K-S(LF)(SN); ARROW_PRICE-STOCK: https://www.arrow.com/en/products/b5b-ph-k-s-lf-sn/jst-manufacturing; DESCRIPTION: PH-2.0mm Header top entry 5 way JST PH Series, Series Number B5B, 2mm Pitch 5 Way 1 Row Straight PCB Header, Through Hole Termination, 2A; HEIGHT: 6mm; MANUFACTURER_NAME: JST (JAPAN SOLDERLESS TERMINALS); MANUFACTURER_PART_NUMBER: B5B-PH-K-S(LF)(SN)
R1-R10 R22 = Samacsys:ERA3AED203V: Metal Film (Thin Film) Chip Resistor 0603 203 Source: Datasheet <https://industrial.panasonic.com/cdbs/www-data/pdf/RDM0000/AOA0000C307.pdf>; ARROW_PART_NUMBER: ERA3AED203V; ARROW_PRICE-STOCK: https://www.arrow.com/en/products/era-3aed203v/panasonic; DESCRIPTION: Metal Film (Thin Film) Chip Resistor 0603 203; HEIGHT: 0.55mm; MANUFACTURER_NAME: Panasonic; MANUFACTURER_PART_NUMBER: ERA3AED203V
R11 R12 R27 R28 R32 = Samacsys:RG1608P-102-B-T5: SUSUMU - RG1608P-102-B-T5 - RES, 1K, 0.1%, 0.1W, 0603, THIN FILM Source: Datasheet <https://www.mouser.com/datasheet/2/392/n_catalog_partition01_en-1140338.pdf>; DESCRIPTION: SUSUMU - RG1608P-102-B-T5 - RES, 1K, 0.1%, 0.1W, 0603, THIN FILM; HEIGHT: 0.5mm; MANUFACTURER_NAME: Susumu; MANUFACTURER_PART_NUMBER: RG1608P-102-B-T5; MOUSER_PART_NUMBER: 754-RG1608P-102-B-T5; MOUSER_PRICE-STOCK: https://www.mouser.co.uk/ProductDetail/Susumu/RG1608P-102-B-T5/?qs=juJhw1yPxAFF3yUnnzQ0fQ%3D%3D
R13 R14 R29 R30 = Samacsys:ERA3AEB101V: PANASONIC ELECTRONIC COMPONENTS - ERA3AEB101V - RES, THIN FILM, 100R, 0.1%, 0.1W, 0603 Source: Datasheet <https://industrial.panasonic.com/cdbs/www-data/pdf/RDM0000/AOA0000C307.pdf>; DESCRIPTION: PANASONIC ELECTRONIC COMPONENTS - ERA3AEB101V - RES, THIN FILM, 100R, 0.1%, 0.1W, 0603; HEIGHT: 0.55mm; MANUFACTURER_NAME: Panasonic; MANUFACTURER_PART_NUMBER: ERA3AEB101V
R15 R18 R38 R39 = Samacsys:RT0603FRD0710RL: Thin Film Resistors,10 Ohms,25 PPM / C,100 mW (1/10 W) Source: Datasheet <http://www.yageo.com/documents/recent/PYu-RT_1-to-0.01_RoHS_L_11.pdf>; DESCRIPTION: Thin Film Resistors,10 Ohms,25 PPM / C,100 mW (1/10 W); HEIGHT: 0.55mm; MANUFACTURER_NAME: YAGEO (PHYCOMP); MANUFACTURER_PART_NUMBER: RT0603FRD0710RL; MOUSER_PART_NUMBER: 603-RT0603FRD0710RL; MOUSER_PRICE-STOCK: https://www.mouser.co.uk/ProductDetail/Yageo/RT0603FRD0710RL/?qs=k2KEx2DUIRT6hVLH%252BBT1HQ%3D%3D
R16 R17 = Samacsys:ERJ-PA3J220V: Panasonic ERJPA3 0603 Resistor Chip Source: Datasheet <https://industrial.panasonic.com/cdbs/www-data/pdf/RDA0000/AOA0000C243.pdf>; ARROW_PART_NUMBER: ERJ-PA3J220V; ARROW_PRICE-STOCK: https://www.arrow.com/en/products/erj-pa3j220v/panasonic; DESCRIPTION: Panasonic ERJPA3 0603 Resistor Chip; HEIGHT: 0.55mm; MANUFACTURER_NAME: Panasonic; MANUFACTURER_PART_NUMBER: ERJ-PA3J220V; MOUSER_PART_NUMBER: 667-ERJ-PA3J220V; MOUSER_PRICE-STOCK: https://www.mouser.co.uk/ProductDetail/Panasonic/ERJ-PA3J220V/?qs=BzJM0faLVqUbiTCGjSJBqQ%3D%3D
R19 R31 R36 = Samacsys:RT0603FRE0710KL: THIN FILM CHIP RESISTORS Source: Datasheet <http://www.yageo.com/documents/recent/PYu-RT_1-to-0.05_RoHS_L_6.pdf>; ARROW_PART_NUMBER: RT0603FRE0710KL; ARROW_PRICE-STOCK: https://www.arrow.com/en/products/rt0603fre0710kl/yageo; DESCRIPTION: THIN FILM CHIP RESISTORS; HEIGHT: 0.55mm; MANUFACTURER_NAME: YAGEO (PHYCOMP); MANUFACTURER_PART_NUMBER: RT0603FRE0710KL; MOUSER_PART_NUMBER: 603-RT0603FRE0710KL; MOUSER_PRICE-STOCK: https://www.mouser.co.uk/ProductDetail/Yageo/RT0603FRE0710KL/?qs=8cPjvKtxWv43uywOotU9ew%3D%3D
R20 R44-R46 = Samacsys:RT0603FRE0722KL: RESISTOR, 0603 22K Ohms +/-1% 1/10 W Source: Datasheet <http://uk.rs-online.com/web/p/products/6177099>; ARROW_PART_NUMBER: RT0603FRE0722KL; ARROW_PRICE-STOCK: https://www.arrow.com/en/products/rt0603fre0722kl/yageo; DESCRIPTION: RESISTOR, 0603 22K Ohms +/-1% 1/10 W; HEIGHT: 0.55mm; MANUFACTURER_NAME: YAGEO (PHYCOMP); MANUFACTURER_PART_NUMBER: RT0603FRE0722KL; MOUSER_PART_NUMBER: 603-RT0603FRE0722KL; MOUSER_PRICE-STOCK: https://www.mouser.co.uk/ProductDetail/Yageo/RT0603FRE0722KL?qs=8cPjvKtxWv5K57Or6cULvw%3D%3D
R21 = Samacsys:ERJ-3RBD1200V: ERJ3R Resistor,0.1W,120 Ohms,0.5% Panasonic Thick Film Surface Mount Resistor 0603 Case 120 +/-0.5% 0.1W +/-50ppm/C Source: Datasheet <http://docs-europe.electrocomponents.com/webdocs/13ba/0900766b813ba21b.pdf>; DESCRIPTION: ERJ3R Resistor,0.1W,120 Ohms,0.5% Panasonic Thick Film Surface Mount Resistor 0603 Case 120 +/-0.5% 0.1W +/-50ppm/C; HEIGHT: 0.55mm; MANUFACTURER_NAME: Panasonic; MANUFACTURER_PART_NUMBER: ERJ-3RBD1200V; MOUSER_PART_NUMBER: 667-ERJ-3RBD1200V; MOUSER_PRICE-STOCK: https://www.mouser.co.uk/ProductDetail/Panasonic/ERJ-3RBD1200V/?qs=KTDjhDDUMAn3RR1z5n7W4A%3D%3D
R23 R50 = Samacsys:RC0603JR-1047KL: YAGEO - RC0603JR-1047KL - RES, THICK FILM, 47K, 5%, 0.1W, 0603 Source: Datasheet <http://www.yageo.com/documents/recent/PYu-RC0603_51_RoHS_L_v5.pdf>; ARROW_PART_NUMBER: RC0603JR-1047KL; ARROW_PRICE-STOCK: https://www.arrow.com/en/products/rc0603jr-1047kl/yageo; DESCRIPTION: YAGEO - RC0603JR-1047KL - RES, THICK FILM, 47K, 5%, 0.1W, 0603; HEIGHT: 0.55mm; MANUFACTURER_NAME: YAGEO (PHYCOMP); MANUFACTURER_PART_NUMBER: RC0603JR-1047KL; MOUSER_PART_NUMBER: 603-RC0603JR-1047KL; MOUSER_PRICE-STOCK: https://www.mouser.co.uk/ProductDetail/Yageo/RC0603JR-1047KL/?qs=fRxXYNj8ftFCH6obQ4GdBw%3D%3D
R24 R40 R41 = Samacsys:ERA-3AEB103V: Thin Film Resistors - SMD 0603 1/10W 10Kohms 0.1% 25ppm Source: Datasheet <https://industrial.panasonic.com/cdbs/www-data/pdf/RDM0000/AOA0000C307.pdf>; ARROW_PART_NUMBER: ERA-3AEB103V; ARROW_PRICE-STOCK: https://www.arrow.com/en/products/era-3aeb103v/panasonic; DESCRIPTION: Thin Film Resistors - SMD 0603 1/10W 10Kohms 0.1% 25ppm; HEIGHT: 0.55mm; MANUFACTURER_NAME: Panasonic; MANUFACTURER_PART_NUMBER: ERA-3AEB103V; MOUSER_PART_NUMBER: 667-ERA-3AEB103V; MOUSER_PRICE-STOCK: https://www.mouser.co.uk/ProductDetail/Panasonic/ERA-3AEB103V/?qs=1VWA5LkbEaprA2zo9bMIGA%3D%3D
R25 R47-R49 = Samacsys:ERJ3RBD4701V: ERJ3R Resistor,0.1W,4.7k Ohms,0.5% Panasonic Thick Film Surface Mount Resistor 0603 Case 4.7kOhm /-0.5% 0.1W /-50ppm/degC Source: Datasheet <http://docs-europe.electrocomponents.com/webdocs/13ba/0900766b813ba21b.pdf>; DESCRIPTION: ERJ3R Resistor,0.1W,4.7k Ohms,0.5% Panasonic Thick Film Surface Mount Resistor 0603 Case 4.7kOhm /-0.5% 0.1W /-50ppm/degC; HEIGHT: 0.55mm; MANUFACTURER_NAME: Panasonic; MANUFACTURER_PART_NUMBER: ERJ3RBD4701V
R26 = resistor:R-US_: RESISTOR, American symbol
R33-R35 R42 R43 R51 R52 = Samacsys:RT0603DRE07100KL: Thin Film Resistors - SMD 100K OHM .5% 50PPM 0603 Source: Datasheet <https://mouser.componentsearchengine.com/Datasheets/1/RT0603DRE07100KL.pdf>; ARROW_PART_NUMBER: RT0603DRE07100KL; ARROW_PRICE-STOCK: https://www.arrow.com/en/products/rt0603dre07100kl/yageo; DESCRIPTION: Thin Film Resistors - SMD 100K OHM .5% 50PPM 0603; HEIGHT: 0.55mm; MANUFACTURER_NAME: YAGEO (PHYCOMP); MANUFACTURER_PART_NUMBER: RT0603DRE07100KL; MOUSER_PART_NUMBER: 603-RT0603DRE07100KL; MOUSER_PRICE-STOCK: https://www.mouser.co.uk/ProductDetail/Yageo/RT0603DRE07100KL/?qs=qk16NiFnx93EdzBTUxxC1w%3D%3D
R37 = Samacsys:RC0603FR-070RL: YAGEO - RC0603FR-070RL - RESISTOR, THICK FILM, 0 OHM, 100MW, 1% Source: Datasheet <https://eu.mouser.com/datasheet/2/447/PYu-RC_Group_51_RoHS_L_10-1664068.pdf>; ARROW_PART_NUMBER: RC0603FR-070RL; ARROW_PRICE-STOCK: https://www.arrow.com/en/products/rc0603fr-070rl/yageo; DESCRIPTION: YAGEO - RC0603FR-070RL - RESISTOR, THICK FILM, 0 OHM, 100MW, 1%; HEIGHT: 0.55mm; MANUFACTURER_NAME: YAGEO (PHYCOMP); MANUFACTURER_PART_NUMBER: RC0603FR-070RL; MOUSER_PART_NUMBER: 603-RC0603FR-070RL; MOUSER_PRICE-STOCK: https://www.mouser.co.uk/ProductDetail/Yageo/RC0603FR-070RL/?qs=0yPvnVz5%2FmpDQv43TwvCfw%3D%3D
T1 = transistor:BC847: NPN TRANSISTOR
TP1-TP4 = testpad:TP: Test pad
Y1 = Samacsys:FA-20H_24.0000MF15Y-W3: Source: Datasheet <https://support.epson.biz/td/api/doc_check.php?dl=brief_FA-20H&lang=en>; HEIGHT: 0.55mm; MANUFACTURER_NAME: Epson Timing; MANUFACTURER_PART_NUMBER: FA-20H 24.0000MF15Y-W3; MOUSER_PART_NUMBER: 732-FA20H-24F15Y-W3; MOUSER_PRICE-STOCK: https://www.mouser.co.uk/ProductDetail/Epson-Timing/FA-20H-240000MF15Y-W3/?qs=CANAagUtPApkFk3vAZ1paA%3D%3D